# Altium project MiniPC.PrjPcb (part 5 of 17)

## Sheet Arria10_Power.SchDoc: Arria 10 Power Inputs
size B; DocumentNumber: 30; SheetNumber: 30; SheetTotal: 46
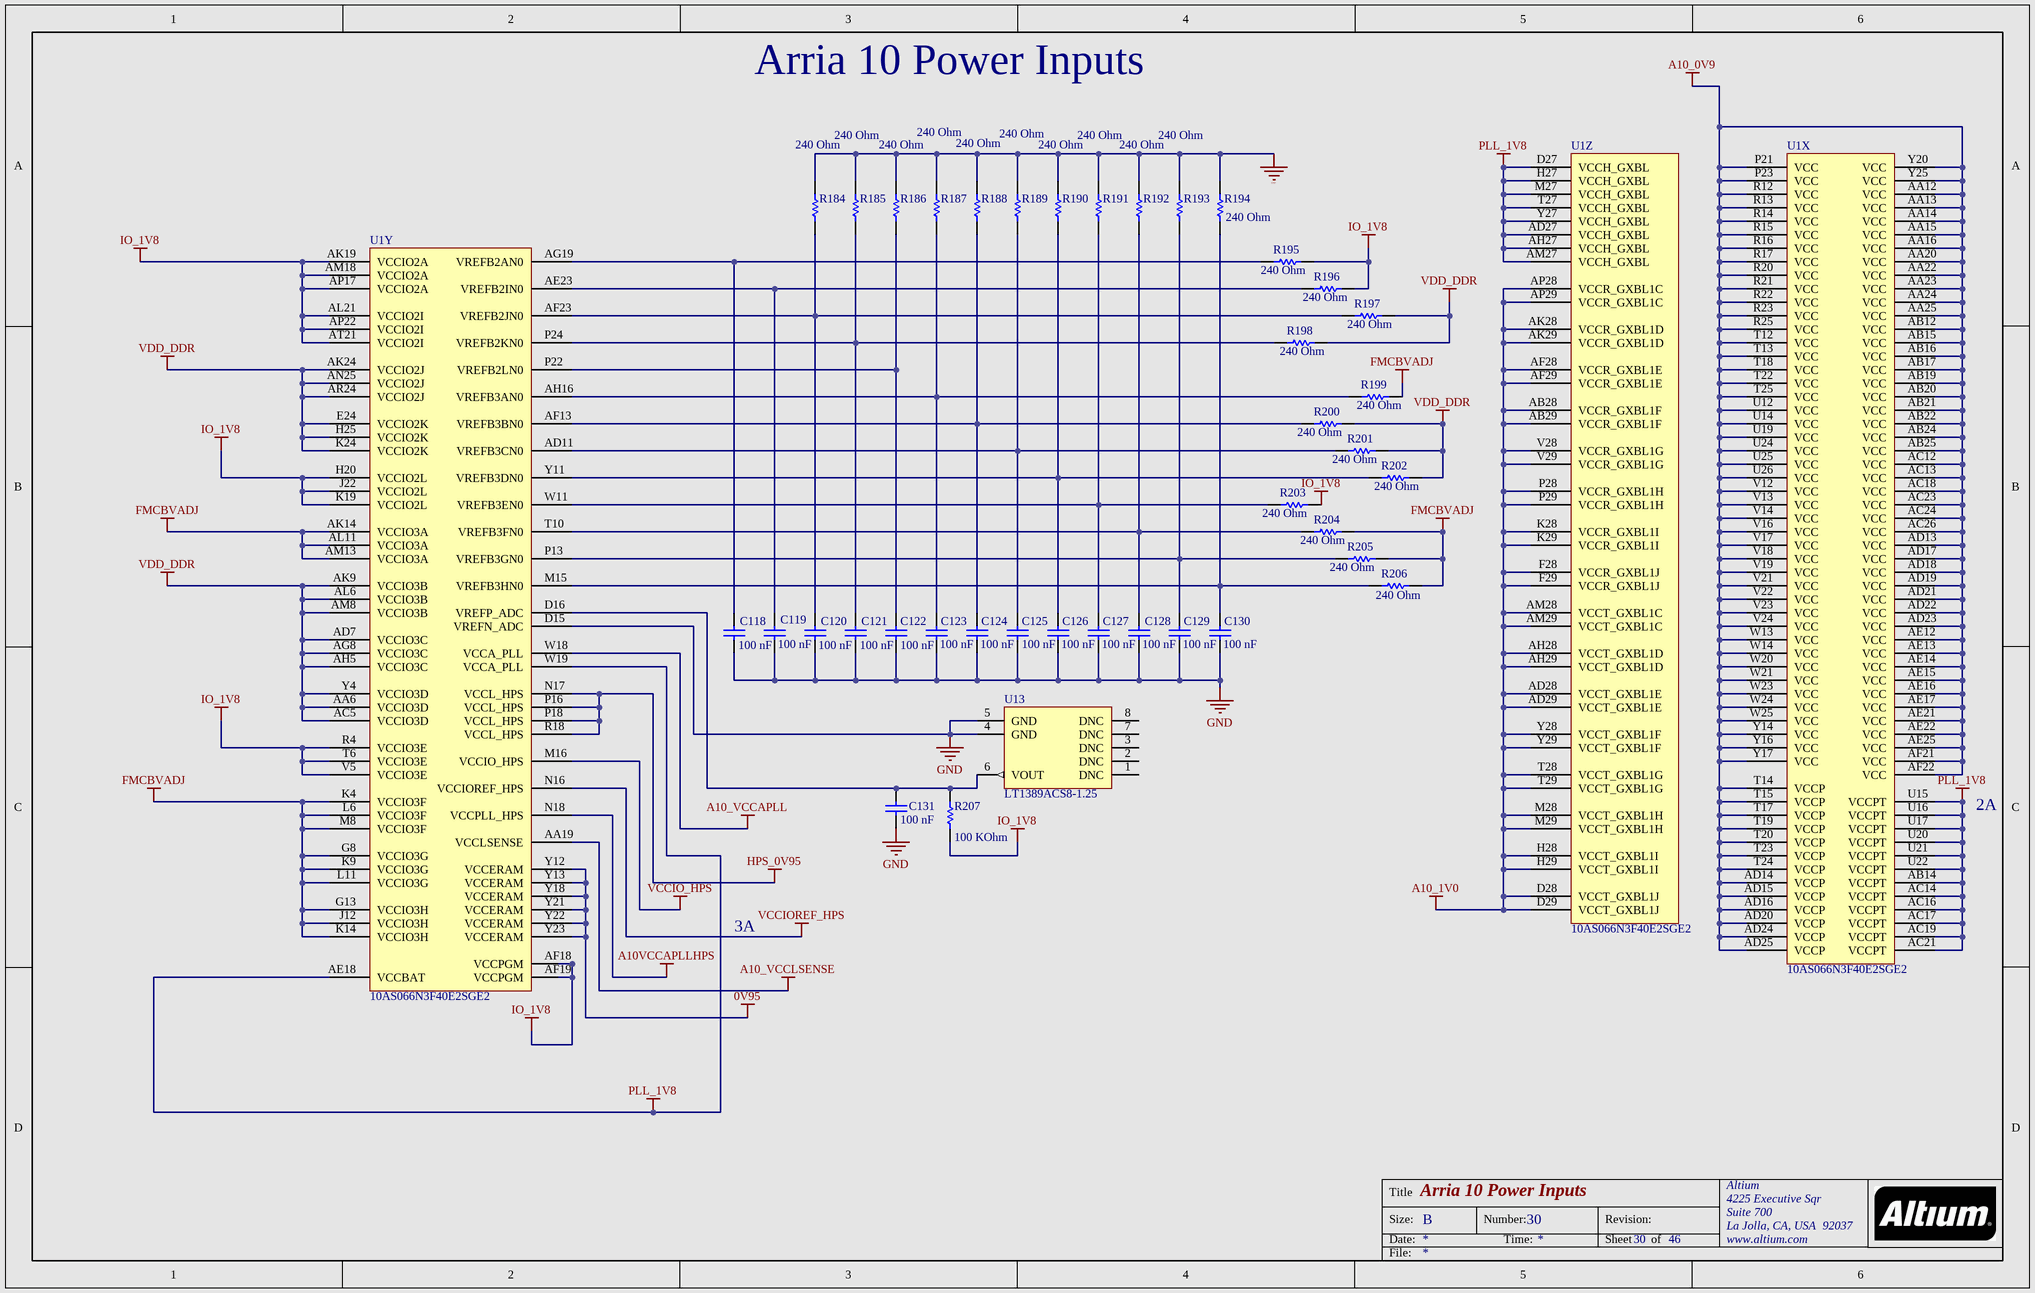
[diagram p19: Arria10_Power.SchDoc]

### Parts
C118  Capacitance: 100 nF  [CAPC0603X33X15LL03T05]  (hidden comment: GRM033R60J104KE19D)
C119  Capacitance: 100 nF  [CAPC0603X33X15LL03T05]  (hidden comment: GRM033R60J104KE19D)
C120  Capacitance: 100 nF  [CAPC0603X33X15LL03T05]  (hidden comment: GRM033R60J104KE19D)
C121  Capacitance: 100 nF  [CAPC0603X33X15LL03T05]  (hidden comment: GRM033R60J104KE19D)
C122  Capacitance: 100 nF  [CAPC0603X33X15LL03T05]  (hidden comment: GRM033R60J104KE19D)
C123  Capacitance: 100 nF  [CAPC0603X33X15LL03T05]  (hidden comment: GRM033R60J104KE19D)
C124  Capacitance: 100 nF  [CAPC0603X33X15LL03T05]  (hidden comment: GRM033R60J104KE19D)
C125  Capacitance: 100 nF  [CAPC0603X33X15LL03T05]  (hidden comment: GRM033R60J104KE19D)
C126  Capacitance: 100 nF  [CAPC0603X33X15LL03T05]  (hidden comment: GRM033R60J104KE19D)
C127  Capacitance: 100 nF  [CAPC0603X33X15LL03T05]  (hidden comment: GRM033R60J104KE19D)
C128  Capacitance: 100 nF  [CAPC0603X33X15LL03T05]  (hidden comment: GRM033R60J104KE19D)
C129  Capacitance: 100 nF  [CAPC0603X33X15LL03T05]  (hidden comment: GRM033R60J104KE19D)
C130  Capacitance: 100 nF  [CAPC0603X33X15LL03T05]  (hidden comment: GRM033R60J104KE19D)
C131  Capacitance: 100 nF  [CAPC1005X55X10LL05]  (hidden comment: C1005X7R1E104M)
R184  Resistance: 240 Ohm  [RESC1005X40X25ML05T05]  (hidden comment: ERJ-2GEJ241x)
R185  Resistance: 240 Ohm  [RESC1005X40X25ML05T05]  (hidden comment: ERJ-2GEJ241x)
R186  Resistance: 240 Ohm  [RESC1005X40X25ML05T05]  (hidden comment: ERJ-2GEJ241x)
R187  Resistance: 240 Ohm  [RESC1005X40X25ML05T05]  (hidden comment: ERJ-2GEJ241x)
R188  Resistance: 240 Ohm  [RESC1005X40X25ML05T05]  (hidden comment: ERJ-2GEJ241x)
R189  Resistance: 240 Ohm  [RESC1005X40X25ML05T05]  (hidden comment: ERJ-2GEJ241x)
R190  Resistance: 240 Ohm  [RESC1005X40X25ML05T05]  (hidden comment: ERJ-2GEJ241x)
R191  Resistance: 240 Ohm  [RESC1005X40X25ML05T05]  (hidden comment: ERJ-2GEJ241x)
R192  Resistance: 240 Ohm  [RESC1005X40X25ML05T05]  (hidden comment: ERJ-2GEJ241x)
R193  Resistance: 240 Ohm  [RESC1005X40X25ML05T05]  (hidden comment: ERJ-2GEJ241x)
R194  Resistance: 240 Ohm  [RESC1005X40X25ML05T05]  (hidden comment: ERJ-2GEJ241x)
R195  Resistance: 240 Ohm  [RESC1005X40X25ML05T05]  (hidden comment: ERJ-2GEJ241x)
R196  Resistance: 240 Ohm  [RESC1005X40X25ML05T05]  (hidden comment: ERJ-2GEJ241x)
R197  Resistance: 240 Ohm  [RESC1005X40X25ML05T05]  (hidden comment: ERJ-2GEJ241x)
R198  Resistance: 240 Ohm  [RESC1005X40X25ML05T05]  (hidden comment: ERJ-2GEJ241x)
R199  Resistance: 240 Ohm  [RESC1005X40X25ML05T05]  (hidden comment: ERJ-2GEJ241x)
R200  Resistance: 240 Ohm  [RESC1005X40X25ML05T05]  (hidden comment: ERJ-2GEJ241x)
R201  Resistance: 240 Ohm  [RESC1005X40X25ML05T05]  (hidden comment: ERJ-2GEJ241x)
R202  Resistance: 240 Ohm  [RESC1005X40X25ML05T05]  (hidden comment: ERJ-2GEJ241x)
R203  Resistance: 240 Ohm  [RESC1005X40X25ML05T05]  (hidden comment: ERJ-2GEJ241x)
R204  Resistance: 240 Ohm  [RESC1005X40X25ML05T05]  (hidden comment: ERJ-2GEJ241x)
R205  Resistance: 240 Ohm  [RESC1005X40X25ML05T05]  (hidden comment: ERJ-2GEJ241x)
R206  Resistance: 240 Ohm  [RESC1005X40X25ML05T05]  (hidden comment: ERJ-2GEJ241x)
R207  Resistance: 100 KOhm  [RESC1005X40X25LL05T05]  (hidden comment: ERJ-2RKF1003X)
U1  10AS066N3F40E2SGE2  [ALTR-FBGA1517_A-350]  (parts X,Y,Z of 31)
U13  LT1389ACS8-1.25  [LT-S8-8_M]

### Nets
0V95: U1.Y12(VCCERAM) U1.Y13(VCCERAM) U1.Y18(VCCERAM) U1.Y21(VCCERAM) U1.Y22(VCCERAM) U1.Y23(VCCERAM)
A10_0V9: U1.AA12(VCC) U1.AA13(VCC) U1.AA14(VCC) U1.AA15(VCC) U1.AA16(VCC) U1.AA20(VCC) U1.AA22(VCC) U1.AA23(VCC) U1.AA24(VCC) U1.AA25(VCC) U1.AB12(VCC) U1.AB15(VCC) U1.AB16(VCC) U1.AB17(VCC) U1.AB19(VCC) U1.AB20(VCC) U1.AB21(VCC) U1.AB22(VCC) U1.AB24(VCC) U1.AB25(VCC) U1.AC12(VCC) U1.AC13(VCC) U1.AC18(VCC) U1.AC23(VCC) U1.AC24(VCC) U1.AC26(VCC) U1.AD13(VCC) U1.AD14(VCCP) U1.AD15(VCCP) U1.AD16(VCCP) U1.AD17(VCC) U1.AD18(VCC) U1.AD19(VCC) U1.AD20(VCCP) U1.AD21(VCC) U1.AD22(VCC) U1.AD23(VCC) U1.AD24(VCCP) U1.AD25(VCCP) U1.AE12(VCC) U1.AE13(VCC) U1.AE14(VCC) U1.AE15(VCC) U1.AE16(VCC) U1.AE17(VCC) U1.AE21(VCC) U1.AE22(VCC) U1.AE25(VCC) U1.AF21(VCC) U1.AF22(VCC) U1.P21(VCC) U1.P23(VCC) U1.R12(VCC) U1.R13(VCC) U1.R14(VCC) U1.R15(VCC) U1.R16(VCC) U1.R17(VCC) U1.R20(VCC) U1.R21(VCC) U1.R22(VCC) U1.R23(VCC) U1.R25(VCC) U1.T12(VCC) U1.T13(VCC) U1.T14(VCCP) U1.T15(VCCP) U1.T17(VCCP) U1.T18(VCC) U1.T19(VCCP) U1.T20(VCCP) U1.T22(VCC) U1.T23(VCCP) U1.T24(VCCP) U1.T25(VCC) U1.U12(VCC) U1.U14(VCC) U1.U19(VCC) U1.U24(VCC) U1.U25(VCC) U1.U26(VCC) U1.V12(VCC) U1.V13(VCC) U1.V14(VCC) U1.V16(VCC) U1.V17(VCC) U1.V18(VCC) U1.V19(VCC) U1.V21(VCC) U1.V22(VCC) U1.V23(VCC) U1.V24(VCC) U1.W13(VCC) U1.W14(VCC) U1.W20(VCC) U1.W21(VCC) U1.W23(VCC) U1.W24(VCC) U1.W25(VCC) U1.Y14(VCC) U1.Y16(VCC) U1.Y17(VCC) U1.Y20(VCC) U1.Y25(VCC)
A10_1V0: U1.AB28(VCCR_GXBL1F) U1.AB29(VCCR_GXBL1F) U1.AD28(VCCT_GXBL1E) U1.AD29(VCCT_GXBL1E) U1.AF28(VCCR_GXBL1E) U1.AF29(VCCR_GXBL1E) U1.AH28(VCCT_GXBL1D) U1.AH29(VCCT_GXBL1D) U1.AK28(VCCR_GXBL1D) U1.AK29(VCCR_GXBL1D) U1.AM28(VCCT_GXBL1C) U1.AM29(VCCT_GXBL1C) U1.AP28(VCCR_GXBL1C) U1.AP29(VCCR_GXBL1C) U1.D28(VCCT_GXBL1J) U1.D29(VCCT_GXBL1J) U1.F28(VCCR_GXBL1J) U1.F29(VCCR_GXBL1J) U1.H28(VCCT_GXBL1I) U1.H29(VCCT_GXBL1I) U1.K28(VCCR_GXBL1I) U1.K29(VCCR_GXBL1I) U1.M28(VCCT_GXBL1H) U1.M29(VCCT_GXBL1H) U1.P28(VCCR_GXBL1H) U1.P29(VCCR_GXBL1H) U1.T28(VCCT_GXBL1G) U1.T29(VCCT_GXBL1G) U1.V28(VCCR_GXBL1G) U1.V29(VCCR_GXBL1G) U1.Y28(VCCT_GXBL1F) U1.Y29(VCCT_GXBL1F)
A10_VCCAPLL: U1.W18(VCCA_PLL)
A10_VCCLSENSE: U1.AA19(VCCLSENSE)
A10VCCAPLLHPS: U1.N18(VCCPLL_HPS)
FMCBVADJ: R199.1 R204.1 R205.1 R206.1 U1.AK14(VCCIO3A) U1.AL11(VCCIO3A) U1.AM13(VCCIO3A) U1.G8(VCCIO3G) U1.G13(VCCIO3H) U1.J12(VCCIO3H) U1.K4(VCCIO3F) U1.K9(VCCIO3G) U1.K14(VCCIO3H) U1.L6(VCCIO3F) U1.L11(VCCIO3G) U1.M8(VCCIO3F)
GND: C118.1 C119.1 C120.1 C121.1 C122.1 C123.1 C124.1 C125.1 C126.1 C127.1 C128.1 C129.1 C130.1 C131.1 R184.2 R185.2 R186.2 R187.2 R188.2 R189.2 R190.2 R191.2 R192.2 R193.2 R194.1 U1.D15(VREFN_ADC) U13.4(GND) U13.5(GND)
HPS_0V95: U1.N17(VCCL_HPS) U1.P16(VCCL_HPS) U1.P18(VCCL_HPS) U1.R18(VCCL_HPS)
IO_1V8: R195.1 R196.1 R203.1 R207.1 U1.AF18(VCCPGM) U1.AF19(VCCPGM) U1.AK19(VCCIO2A) U1.AL21(VCCIO2I) U1.AM18(VCCIO2A) U1.AP17(VCCIO2A) U1.AP22(VCCIO2I) U1.AT21(VCCIO2I) U1.H20(VCCIO2L) U1.J22(VCCIO2L) U1.K19(VCCIO2L) U1.R4(VCCIO3E) U1.T6(VCCIO3E) U1.V5(VCCIO3E)
PLL_1V8: U1.AB14(VCCPT) U1.AC14(VCCPT) U1.AC16(VCCPT) U1.AC17(VCCPT) U1.AC19(VCCPT) U1.AC21(VCCPT) U1.AD27(VCCH_GXBL) U1.AE18(VCCBAT) U1.AH27(VCCH_GXBL) U1.AM27(VCCH_GXBL) U1.D27(VCCH_GXBL) U1.H27(VCCH_GXBL) U1.M27(VCCH_GXBL) U1.T27(VCCH_GXBL) U1.U15(VCCPT) U1.U16(VCCPT) U1.U17(VCCPT) U1.U20(VCCPT) U1.U21(VCCPT) U1.U22(VCCPT) U1.W19(VCCA_PLL) U1.Y27(VCCH_GXBL)
VCCIO_HPS: U1.M16(VCCIO_HPS)
VCCIOREF_HPS: U1.N16(VCCIOREF_HPS)
VDD_DDR: R197.1 R198.1 R200.1 R201.1 R202.1 U1.AA6(VCCIO3D) U1.AC5(VCCIO3D) U1.AD7(VCCIO3C) U1.AG8(VCCIO3C) U1.AH5(VCCIO3C) U1.AK9(VCCIO3B) U1.AK24(VCCIO2J) U1.AL6(VCCIO3B) U1.AM8(VCCIO3B) U1.AN25(VCCIO2J) U1.AR24(VCCIO2J) U1.E24(VCCIO2K) U1.H25(VCCIO2K) U1.K24(VCCIO2K) U1.Y4(VCCIO3D)
NetC118_2: C118.2 R195.2 U1.AG19(VREFB2AN0)
NetC119_2: C119.2 R196.2 U1.AE23(VREFB2IN0)
NetC120_2: C120.2 R184.1 R197.2 U1.AF23(VREFB2JN0)
NetC121_2: C121.2 R185.1 R198.2 U1.P24(VREFB2KN0)
NetC122_2: C122.2 R186.1 U1.P22(VREFB2LN0)
NetC123_2: C123.2 R187.1 R199.2 U1.AH16(VREFB3AN0)
NetC124_2: C124.2 R188.1 R200.2 U1.AF13(VREFB3BN0)
NetC125_2: C125.2 R189.1 R201.2 U1.AD11(VREFB3CN0)
NetC126_2: C126.2 R190.1 R202.2 U1.Y11(VREFB3DN0)
NetC127_2: C127.2 R191.1 R203.2 U1.W11(VREFB3EN0)
NetC128_2: C128.2 R192.1 R204.2 U1.T10(VREFB3FN0)
NetC129_2: C129.2 R193.1 R205.2 U1.P13(VREFB3GN0)
NetC130_2: C130.2 R194.2 R206.2 U1.M15(VREFB3HN0)
NetC131_2: C131.2 R207.2 U1.D16(VREFP_ADC) U13.6(VOUT)

Not connected (* = marked no-connect by the designer): U13 1(DNC) 2(DNC) 3(DNC) 7(DNC) 8(DNC)

### Notes on the sheet
- 2A
- 3A
- Title
- Size:
- Date:
- B
- Number:
- Time:
- Revision:
- Sheet
- of
- File:

### Library data of the parts
C118-C130 = CMP-2010-01652-4: Chip Capacitor, 100 nF, +/- 10%, 6.3 V, -55 to 85 degC, 0201 (0603 Metric), RoHS, Tape and Reel; Manufacturer: Basic Passives; Voltage Rating: 6.3 V; Type (Capacitors): X5R; Voltage Rating (DC): 3 V; Case\/Package: 0201; Tolerance: 10%; Min Operating Temperature: -55 degC; PartNumber: GRM033R60J104KE19D; Mounting Technology: Surface Mount; RoHSCompliant: true; Max Operating Temperature: 85 degC; Package Quantity: 15000; Packaging: Tape and Reel; Case Code (Imperial): 0201; Width: 0.3 mm; ComponentLink1URL: http://www.murata.com/; Case Code (Metric): 0603; ComponentLink1Description: Manufacturer URL; REACH SVHC: No SVHC; Height: 0.3 mm; Length: 0.6 mm; PackageDescription: 2-Pin Surface Mount Device, Body 0.6 x 0.3 mm; ComponentLink2Description: Datasheet; Pins: 2; PackageReference: 0201; Mount: Surface Mount; ComponentLink2URL: http://search.murata.co.jp/Ceramy/image/img/A01X/G101/ENG/GRM033R60J104KE19-01.pdf; DatasheetVersion: 03/2016; Radiation Hardening: No
C131 = CMP-1663-00009-2: Chip Capacitor, 0.1 uF, +/- 20%, 25 V, -55 to 125 degC, 0402 (1005 Metric), RoHS, Tape and Reel; Type (Capacitors): X7R; Voltage Rating: 25 V; Case\/Package: 0402; Tolerance: 20%; Mounting Technology: Surface Mount; Max Operating Temperature: 125 degC; ComponentLink2URL: http://www.farnell.com/datasheets/1571323.pdf; ComponentLink1URL: http://www.tdk.com/; RoHSCompliant: true; Packaging: Tape and Reel; ComponentLink2Description: Datasheet; Case Code (Imperial): 0402; DatasheetVersion: 09/2011; ComponentLink1Description: Manufacturer URL; PackageDescription: 2-Pin Surface Mount Device, Body 1 x 0.5 mm; PackageReference: 0402; Min Operating Temperature: -55 degC; Case Code (Metric): 1005; Height: 0.5 mm; Package Quantity: 10000; Width: 0.5 mm; Pins: 2; Voltage Rating (DC): 25 V; PartNumber: C1005X7R1E104M; Mount: Surface Mount; Length: 1 mm
R184-R206 = CMP-2002-00493-3: Chip Resistor, 240 Ohm, +/- 5%, 100 mW, -55 to 155 degC, 0402 (1005 Metric), RoHS, Tape and Reel; Manufacturer: Basic Passives; Power Rating: 100 mW; Voltage Rating: 50 V; Case\/Package: 0402; Tolerance: 5%; Height: 0.35 mm; Case Code (Imperial): 0402; Width: 0.5 mm; Case Code (Metric): 1005; Min Operating Temperature: -55 degC; Package Quantity: 10000; PartNumber: ERJ-2GEJ241x; ComponentLink1Description: Manufacturer URL; REACH SVHC: Yes; Length: 1 mm; Mount: Surface Mount; ComponentLink1URL: http://www.panasonic.com/; Packaging: Tape and Reel; PackageDescription: 2-Pin Surface Mount Device, Body 1 x 0.5 mm; RoHSCompliant: true; Max Operating Temperature: 155 degC; Mounting Technology: Surface Mount; PackageReference: 0402; ComponentLink2Description: Datasheet; Radiation Hardening: No; DatasheetVersion: 03/2015; Pins: 2; ComponentLink2URL: http://industrial.panasonic.com/cdbs/www-data/pdf/RDA0000/AOA0000C84.pdf
R207 = CMP-2002-00608-3: Chip Resistor, 100 KOhm, +/- 1%, 100 mW, -55 to 155 degC, 0402 (1005 Metric), RoHS, Tape and Reel; Manufacturer: Basic Passives; Voltage Rating: 50 V; Power Rating: 100 mW; Case\/Package: 0402; Tolerance: 1%; Height: 0.35 mm; ComponentLink1Description: Manufacturer URL; Packaging: Tape and Reel; Min Operating Temperature: -55 degC; RoHSCompliant: true; PackageDescription: 2-Pin Surface Mount Device, Body 1 x 0.5 mm; Mount: Surface Mount; Package Quantity: 10000; Max Operating Temperature: 155 degC; ComponentLink1URL: http://www.panasonic.com/; Mounting Technology: Surface Mount; PartNumber: ERJ-2RKF1003X; Case Code (Metric): 1005; Case Code (Imperial): 0402; REACH SVHC: Yes; Length: 1 mm; Width: 0.5 mm; DatasheetVersion: 04/2015; Pins: 2; ComponentLink2Description: Datasheet; ComponentLink2URL: http://industrial.panasonic.com/cdbs/www-data/pdf/RDA0000/AOA0000C86.pdf; PackageReference: 0402; Radiation Hardening: No
U1 = CMP-1689-00006-3: Arria 10 SX Family, 588 I/O Pins, 16 Fractional PLLs, 1517-Pin FBGA, Speed Grade 2, Extended Grade, RoHS; ComponentLink3Description: Package Specification; PackageVersion: Rev. 5.0, 01/2016; ComponentLink3URL: https://www.altera.com/content/dam/altera-www/global/en_US/pdfs/literature/packaging/04r00461-04.pdf; ComponentLink2Description: Datasheet; Code_JEDEC: MS-034; Mounting Technology: Surface Mount; PartNumber: 10AS066N3F40E2SGE2; PackageDescription: 1517-Pin FineLine Ball-Grid Array (FBGA), Body 40 x 40 mm, Pitch 1 mm; ComponentLink2URL: https://www.altera.com/content/dam/altera-www/global/en_US/pdfs/literature/hb/arria-10/a10_datasheet.pdf; ComponentLink1URL: https://www.altera.com/; DatasheetVersion: Rev. 2016-06-24, 06/2016; ComponentLink1Description: Manufacturer URL
U13 = CMP-1701-00004-2: Nanopower Precision Shunt Voltage Reference, 1.25 V, 0.05%, 10 ppm/degC, 0 to 70 degC, 8-Pin S8, Tube; Current - Cathode: 600µA; Output Type: Fixed; Current - Output: 20mA; Noise - 0.1Hz to 10Hz: 25µVp-p; Voltage - Output (Min/Fixed): 1.25V; Product Training Modules: Voltage Reference Basics; Temperature Coefficient: 10ppm/°C; ComponentLink2URL: http://cds.linear.com/docs/en/datasheet/1389fa.pdf; Tolerance: ±0.05%; Series: -; Family: PMIC - Voltage Reference; Mounting Type: Surface Mount; ComponentLink1Description: Manufacturer URL; Noise - 10Hz to 10kHz: -; Category: Integrated Circuits (ICs); Operating Temperature: 0°C ~ 70°C (TA); Current - Supply: -; Standard Package: 100; DatasheetVersion: Rev. A; Reference Type: Shunt; Voltage - Input: -; Package / Case: 8-SOIC (0.154&quot;, 3.90mm Width); Mounting Technology: Surface Mount; ComponentLink1URL: http://www.linear.com/; ComponentLink2Description: Datasheet; Packaging: Tube; PackageDescription: 8-Pin Small Outline Integrated Package, Body 5 x 4 mm, Pitch 1.27 mm; Voltage - Output (Max): -; PartNumber: LT1389ACS8-1.25

## Sheet Arria10_Ground.SchDoc: Arria 10 Ground Connections
size B; DocumentNumber: 29; SheetNumber: 29; SheetTotal: 46
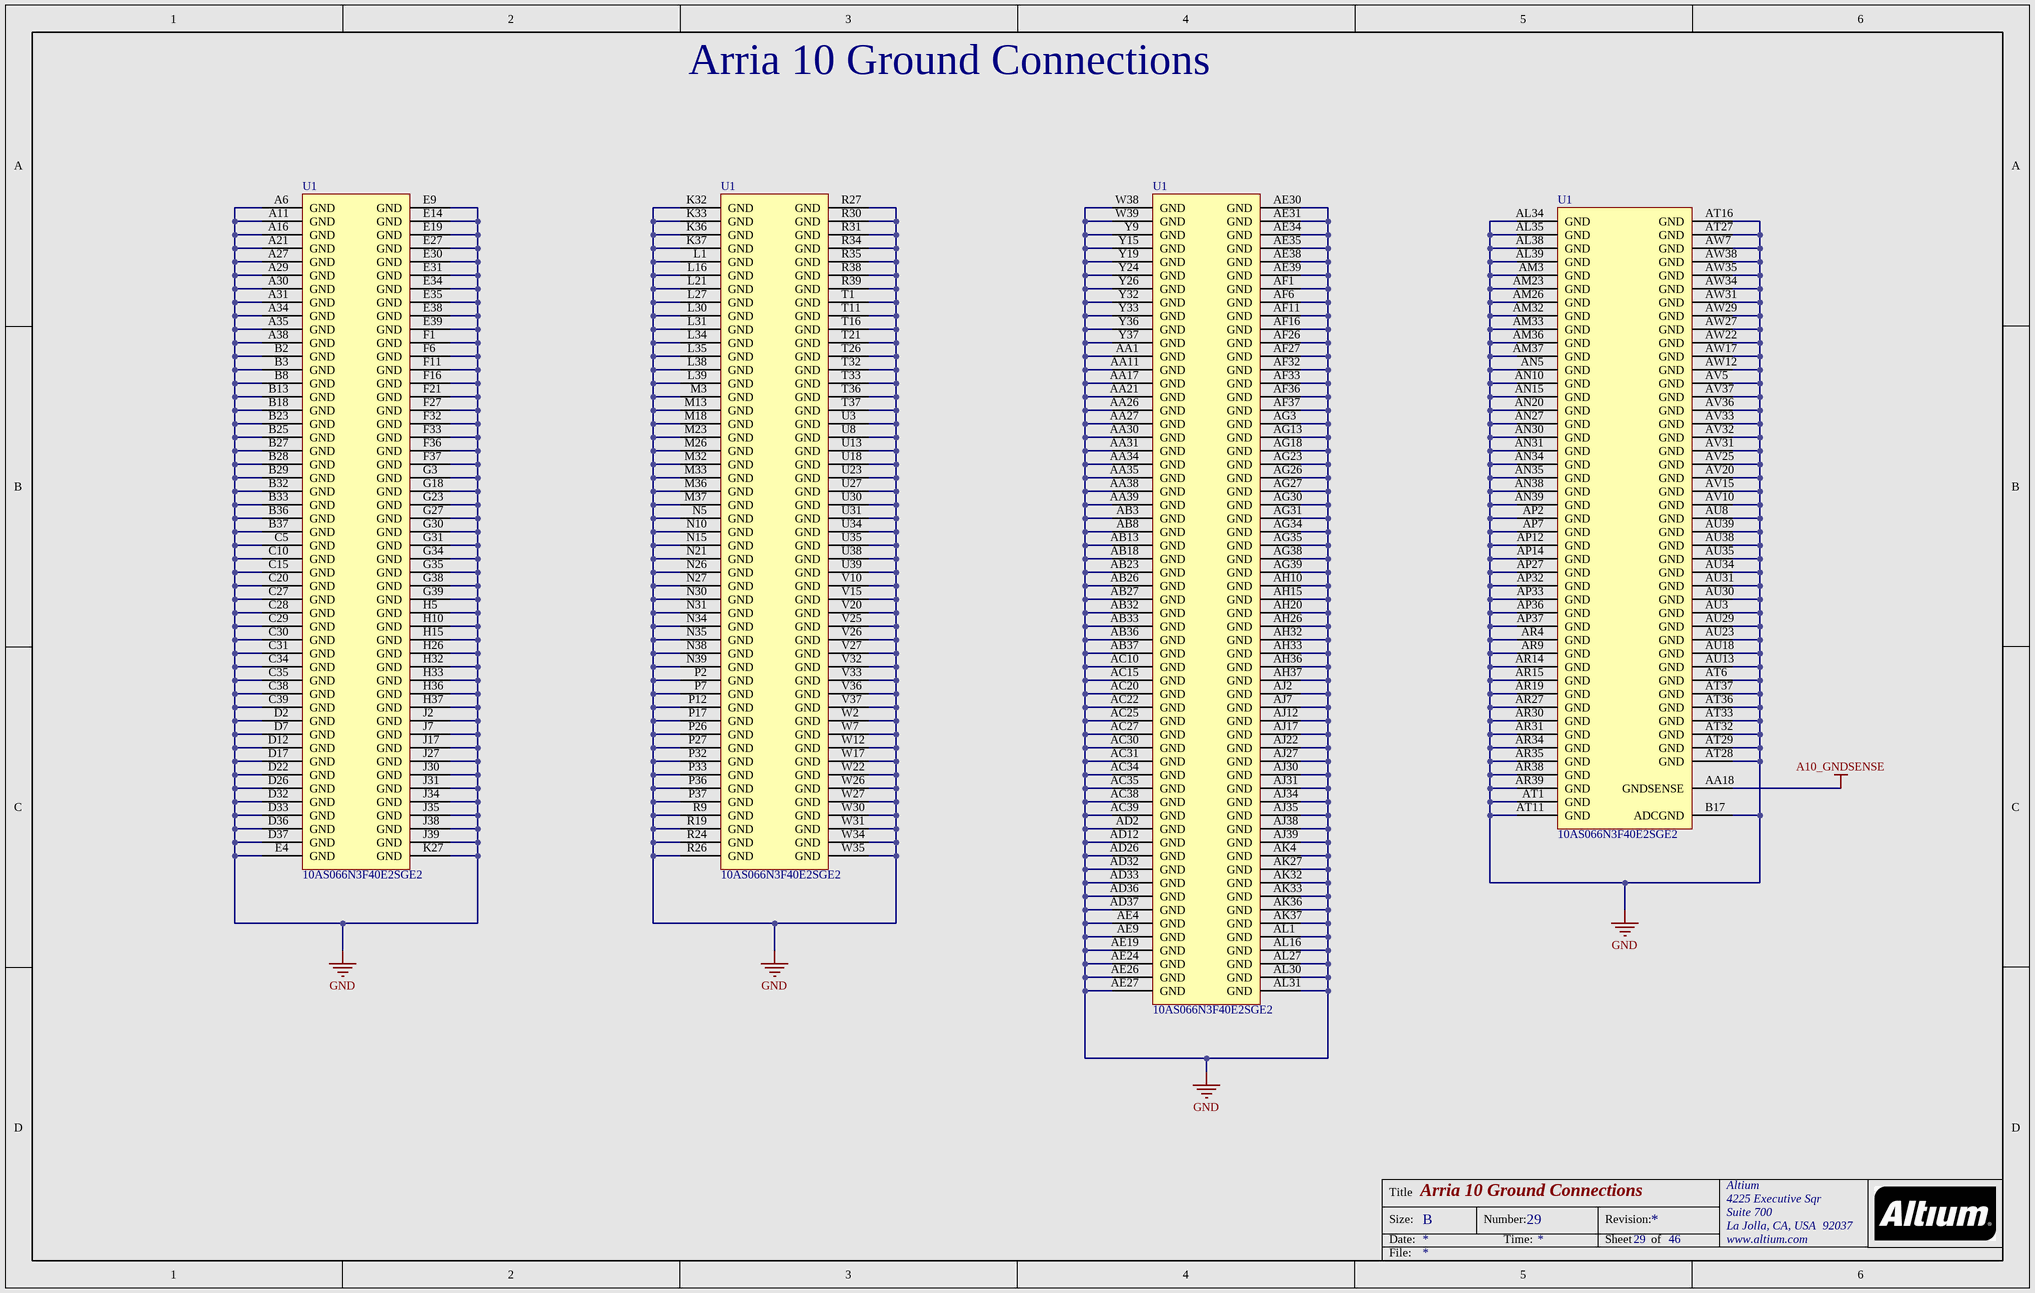
[diagram p20: Arria10_Ground.SchDoc]

### Parts
U1  10AS066N3F40E2SGE2  [ALTR-FBGA1517_A-350]  (parts 27,28,29,30 of 31)

### Nets
A10_GNDSENSE: U1.AA18(GNDSENSE)
GND: U1.A6(GND) U1.A11(GND) U1.A16(GND) U1.A21(GND) U1.A27(GND) U1.A29(GND) U1.A30(GND) U1.A31(GND) U1.A34(GND) U1.A35(GND) U1.A38(GND) U1.AA1(GND) U1.AA11(GND) U1.AA17(GND) U1.AA21(GND) U1.AA26(GND) U1.AA27(GND) U1.AA30(GND) U1.AA31(GND) U1.AA34(GND) U1.AA35(GND) U1.AA38(GND) U1.AA39(GND) U1.AB3(GND) U1.AB8(GND) U1.AB13(GND) U1.AB18(GND) U1.AB23(GND) U1.AB26(GND) U1.AB27(GND) U1.AB32(GND) U1.AB33(GND) U1.AB36(GND) U1.AB37(GND) U1.AC10(GND) U1.AC15(GND) U1.AC20(GND) U1.AC22(GND) U1.AC25(GND) U1.AC27(GND) U1.AC30(GND) U1.AC31(GND) U1.AC34(GND) U1.AC35(GND) U1.AC38(GND) U1.AC39(GND) U1.AD2(GND) U1.AD12(GND) U1.AD26(GND) U1.AD32(GND) U1.AD33(GND) U1.AD36(GND) U1.AD37(GND) U1.AE4(GND) U1.AE9(GND) U1.AE19(GND) U1.AE24(GND) U1.AE26(GND) U1.AE27(GND) U1.AE30(GND) U1.AE31(GND) U1.AE34(GND) U1.AE35(GND) U1.AE38(GND) U1.AE39(GND) U1.AF1(GND) U1.AF6(GND) U1.AF11(GND) U1.AF16(GND) U1.AF26(GND) U1.AF27(GND) U1.AF32(GND) U1.AF33(GND) U1.AF36(GND) U1.AF37(GND) U1.AG3(GND) U1.AG13(GND) U1.AG18(GND) U1.AG23(GND) U1.AG26(GND) U1.AG27(GND) U1.AG30(GND) U1.AG31(GND) U1.AG34(GND) U1.AG35(GND) U1.AG38(GND) U1.AG39(GND) U1.AH10(GND) U1.AH15(GND) U1.AH20(GND) U1.AH26(GND) U1.AH32(GND) U1.AH33(GND) U1.AH36(GND) U1.AH37(GND) U1.AJ2(GND) U1.AJ7(GND) U1.AJ12(GND) U1.AJ17(GND) U1.AJ22(GND) U1.AJ27(GND) U1.AJ30(GND) U1.AJ31(GND) U1.AJ34(GND) U1.AJ35(GND) U1.AJ38(GND) U1.AJ39(GND) U1.AK4(GND) U1.AK27(GND) U1.AK32(GND) U1.AK33(GND) U1.AK36(GND) U1.AK37(GND) U1.AL1(GND) U1.AL16(GND) U1.AL27(GND) U1.AL30(GND) U1.AL31(GND) U1.AL34(GND) U1.AL35(GND) U1.AL38(GND) U1.AL39(GND) U1.AM3(GND) U1.AM23(GND) U1.AM26(GND) U1.AM32(GND) U1.AM33(GND) U1.AM36(GND) U1.AM37(GND) U1.AN5(GND) U1.AN10(GND) U1.AN15(GND) U1.AN20(GND) U1.AN27(GND) U1.AN30(GND) U1.AN31(GND) U1.AN34(GND) U1.AN35(GND) U1.AN38(GND) U1.AN39(GND) U1.AP2(GND) U1.AP7(GND) U1.AP12(GND) U1.AP14(GND) U1.AP27(GND) U1.AP32(GND) U1.AP33(GND) U1.AP36(GND) U1.AP37(GND) U1.AR4(GND) U1.AR9(GND) U1.AR14(GND) U1.AR15(GND) U1.AR19(GND) U1.AR27(GND) U1.AR30(GND) U1.AR31(GND) U1.AR34(GND) U1.AR35(GND) U1.AR38(GND) U1.AR39(GND) U1.AT1(GND) U1.AT6(GND) U1.AT11(GND) U1.AT16(GND) U1.AT27(GND) U1.AT28(GND) U1.AT29(GND) U1.AT32(GND) U1.AT33(GND) U1.AT36(GND) U1.AT37(GND) U1.AU3(GND) U1.AU8(GND) U1.AU13(GND) U1.AU18(GND) U1.AU23(GND) U1.AU29(GND) U1.AU30(GND) U1.AU31(GND) U1.AU34(GND) U1.AU35(GND) U1.AU38(GND) U1.AU39(GND) U1.AV5(GND) U1.AV10(GND) U1.AV15(GND) U1.AV20(GND) U1.AV25(GND) U1.AV31(GND) U1.AV32(GND) U1.AV33(GND) U1.AV36(GND) U1.AV37(GND) U1.AW7(GND) U1.AW12(GND) U1.AW17(GND) U1.AW22(GND) U1.AW27(GND) U1.AW29(GND) U1.AW31(GND) U1.AW34(GND) U1.AW35(GND) U1.AW38(GND) U1.B2(GND) U1.B3(GND) U1.B8(GND) U1.B13(GND) U1.B17(ADCGND) U1.B18(GND) U1.B23(GND) U1.B25(GND) U1.B27(GND) U1.B28(GND) U1.B29(GND) U1.B32(GND) U1.B33(GND) U1.B36(GND) U1.B37(GND) U1.C5(GND) U1.C10(GND) U1.C15(GND) U1.C20(GND) U1.C27(GND) U1.C28(GND) U1.C29(GND) U1.C30(GND) U1.C31(GND) U1.C34(GND) U1.C35(GND) U1.C38(GND) U1.C39(GND) U1.D2(GND) U1.D7(GND) U1.D12(GND) U1.D17(GND) U1.D22(GND) U1.D26(GND) U1.D32(GND) U1.D33(GND) U1.D36(GND) U1.D37(GND) U1.E4(GND) U1.E9(GND) U1.E14(GND) U1.E19(GND) U1.E27(GND) U1.E30(GND) U1.E31(GND) U1.E34(GND) U1.E35(GND) U1.E38(GND) U1.E39(GND) U1.F1(GND) U1.F6(GND) U1.F11(GND) U1.F16(GND) U1.F21(GND) U1.F27(GND) U1.F32(GND) U1.F33(GND) U1.F36(GND) U1.F37(GND) U1.G3(GND) U1.G18(GND) U1.G23(GND) U1.G27(GND) U1.G30(GND) U1.G31(GND) U1.G34(GND) U1.G35(GND) U1.G38(GND) U1.G39(GND) U1.H5(GND) U1.H10(GND) U1.H15(GND) U1.H26(GND) U1.H32(GND) U1.H33(GND) U1.H36(GND) U1.H37(GND) U1.J2(GND) U1.J7(GND) U1.J17(GND) U1.J27(GND) U1.J30(GND) U1.J31(GND) U1.J34(GND) U1.J35(GND) U1.J38(GND) U1.J39(GND) U1.K27(GND) U1.K32(GND) U1.K33(GND) U1.K36(GND) U1.K37(GND) U1.L1(GND) U1.L16(GND) U1.L21(GND) U1.L27(GND) U1.L30(GND) U1.L31(GND) U1.L34(GND) U1.L35(GND) U1.L38(GND) U1.L39(GND) U1.M3(GND) U1.M13(GND) U1.M18(GND) U1.M23(GND) U1.M26(GND) U1.M32(GND) U1.M33(GND) U1.M36(GND) U1.M37(GND) U1.N5(GND) U1.N10(GND) U1.N15(GND) U1.N21(GND) U1.N26(GND) U1.N27(GND) U1.N30(GND) U1.N31(GND) U1.N34(GND) U1.N35(GND) U1.N38(GND) U1.N39(GND) U1.P2(GND) U1.P7(GND) U1.P12(GND) U1.P17(GND) U1.P26(GND) U1.P27(GND) U1.P32(GND) U1.P33(GND) U1.P36(GND) U1.P37(GND) U1.R9(GND) U1.R19(GND) U1.R24(GND) U1.R26(GND) U1.R27(GND) U1.R30(GND) U1.R31(GND) U1.R34(GND) U1.R35(GND) U1.R38(GND) U1.R39(GND) U1.T1(GND) U1.T11(GND) U1.T16(GND) U1.T21(GND) U1.T26(GND) U1.T32(GND) U1.T33(GND) U1.T36(GND) U1.T37(GND) U1.U3(GND) U1.U8(GND) U1.U13(GND) U1.U18(GND) U1.U23(GND) U1.U27(GND) U1.U30(GND) U1.U31(GND) U1.U34(GND) U1.U35(GND) U1.U38(GND) U1.U39(GND) U1.V10(GND) U1.V15(GND) U1.V20(GND) U1.V25(GND) U1.V26(GND) U1.V27(GND) U1.V32(GND) U1.V33(GND) U1.V36(GND) U1.V37(GND) U1.W2(GND) U1.W7(GND) U1.W12(GND) U1.W17(GND) U1.W22(GND) U1.W26(GND) U1.W27(GND) U1.W30(GND) U1.W31(GND) U1.W34(GND) U1.W35(GND) U1.W38(GND) U1.W39(GND) U1.Y9(GND) U1.Y15(GND) U1.Y19(GND) U1.Y24(GND) U1.Y26(GND) U1.Y32(GND) U1.Y33(GND) U1.Y36(GND) U1.Y37(GND)

### Notes on the sheet
- Title
- Size:
- Date:
- B
- Number:
- Time:
- Revision:
- Sheet
- of
- File:

### Library data of the parts
U1 = CMP-1689-00006-3: as U1 on sheet Arria10_Power; ComponentLink3Description: Package Specification; PackageVersion: Rev. 5.0, 01/2016; ComponentLink3URL: https://www.altera.com/content/dam/altera-www/global/en_US/pdfs/literature/packaging/04r00461-04.pdf; ComponentLink2Description: Datasheet; Code_JEDEC: MS-034; Mounting Technology: Surface Mount; PartNumber: 10AS066N3F40E2SGE2; PackageDescription: 1517-Pin FineLine Ball-Grid Array (FBGA), Body 40 x 40 mm, Pitch 1 mm; ComponentLink2URL: https://www.altera.com/content/dam/altera-www/global/en_US/pdfs/literature/hb/arria-10/a10_datasheet.pdf; ComponentLink1URL: https://www.altera.com/; DatasheetVersion: Rev. 2016-06-24, 06/2016; ComponentLink1Description: Manufacturer URL

## Sheet DDR4.SchDoc: DDR4
size B; DocumentNumber: 2; SheetNumber: 2; SheetTotal: 46
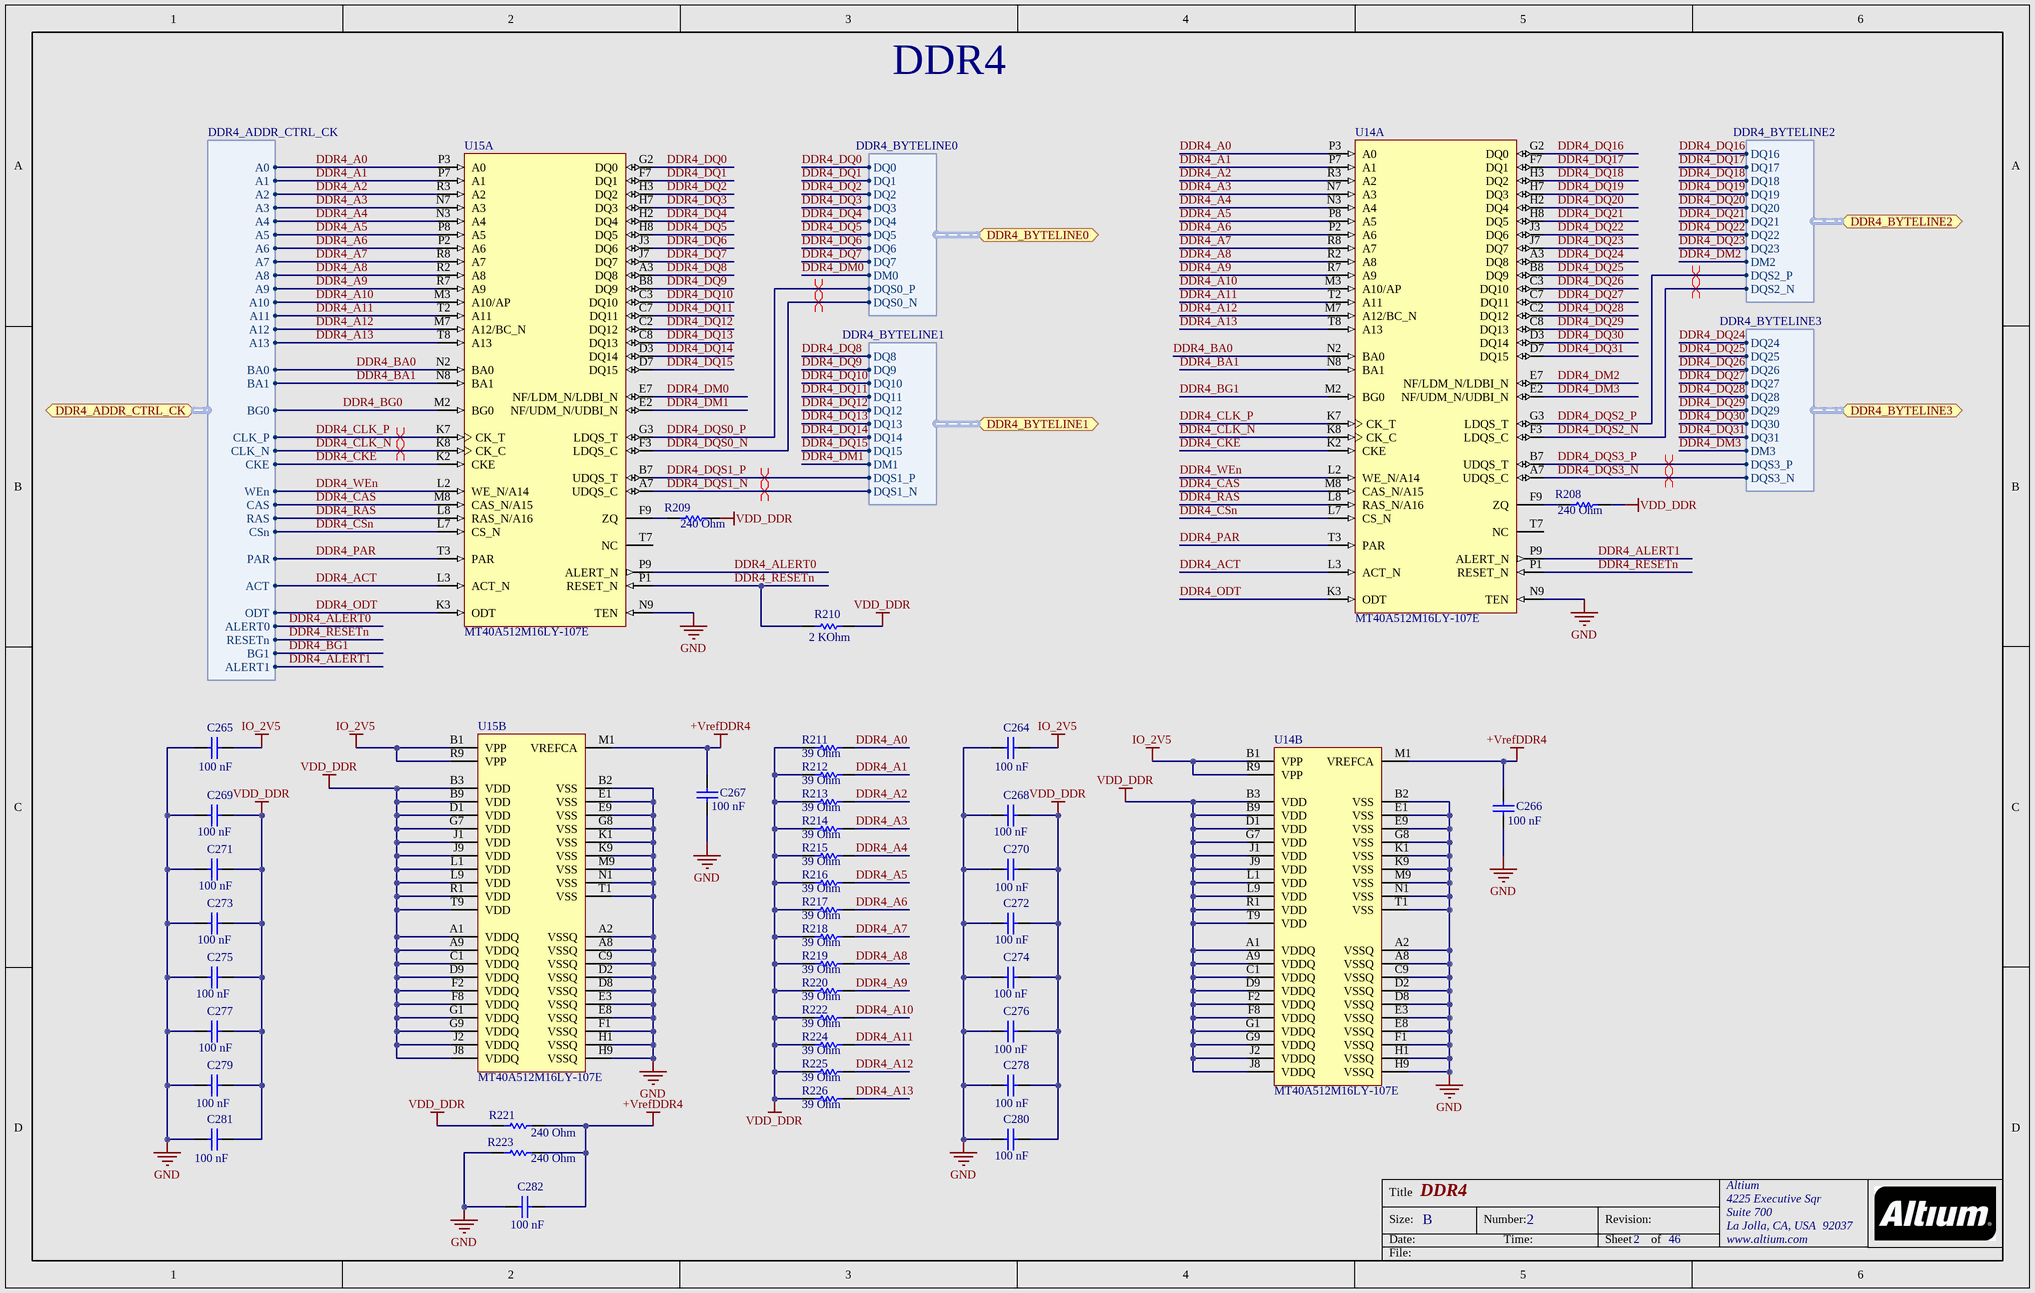
[diagram p21: DDR4.SchDoc]

### Parts
C264  Capacitance: 100 nF  [CAPC0603X33X15LL03T05]  (hidden comment: GRM033R60J104KE19D)
C265  Capacitance: 100 nF  [CAPC0603X33X15LL03T05]  (hidden comment: GRM033R60J104KE19D)
C266  Capacitance: 100 nF  [CAPC0603X33X15LL03T05]  (hidden comment: GRM033R60J104KE19D)
C267  Capacitance: 100 nF  [CAPC0603X33X15LL03T05]  (hidden comment: GRM033R60J104KE19D)
C268  Capacitance: 100 nF  [CAPC0603X33X15LL03T05]  (hidden comment: GRM033R60J104KE19D)
C269  Capacitance: 100 nF  [CAPC0603X33X15LL03T05]  (hidden comment: GRM033R60J104KE19D)
C270  Capacitance: 100 nF  [CAPC0603X33X15LL03T05]  (hidden comment: GRM033R60J104KE19D)
C271  Capacitance: 100 nF  [CAPC0603X33X15LL03T05]  (hidden comment: GRM033R60J104KE19D)
C272  Capacitance: 100 nF  [CAPC0603X33X15LL03T05]  (hidden comment: GRM033R60J104KE19D)
C273  Capacitance: 100 nF  [CAPC0603X33X15LL03T05]  (hidden comment: GRM033R60J104KE19D)
C274  Capacitance: 100 nF  [CAPC0603X33X15LL03T05]  (hidden comment: GRM033R60J104KE19D)
C275  Capacitance: 100 nF  [CAPC0603X33X15LL03T05]  (hidden comment: GRM033R60J104KE19D)
C276  Capacitance: 100 nF  [CAPC0603X33X15LL03T05]  (hidden comment: GRM033R60J104KE19D)
C277  Capacitance: 100 nF  [CAPC0603X33X15LL03T05]  (hidden comment: GRM033R60J104KE19D)
C278  Capacitance: 100 nF  [CAPC0603X33X15LL03T05]  (hidden comment: GRM033R60J104KE19D)
C279  Capacitance: 100 nF  [CAPC0603X33X15LL03T05]  (hidden comment: GRM033R60J104KE19D)
C280  Capacitance: 100 nF  [CAPC0603X33X15LL03T05]  (hidden comment: GRM033R60J104KE19D)
C281  Capacitance: 100 nF  [CAPC0603X33X15LL03T05]  (hidden comment: GRM033R60J104KE19D)
C282  Capacitance: 100 nF  [CAPC0603X33X15LL03T05]  (hidden comment: GRM033R60J104KE19D)
R208  Resistance: 240 Ohm  [RESC1005X40X25NL05T05]  (hidden comment: ERJ-2RKF2400X)
R209  Resistance: 240 Ohm  [RESC1005X40X25NL05T05]  (hidden comment: ERJ-2RKF2400X)
R210  Resistance: 2 KOhm  [RESC1005X40X25NL05T05]  (hidden comment: ERJ-2RKF2001X)
R211  Resistance: 39 Ohm  [RESC1005X40X25NL5T10]  (hidden comment: RC0402JR-0739RL)
R212  Resistance: 39 Ohm  [RESC1005X40X25NL5T10]  (hidden comment: RC0402JR-0739RL)
R213  Resistance: 39 Ohm  [RESC1005X40X25NL5T10]  (hidden comment: RC0402JR-0739RL)
R214  Resistance: 39 Ohm  [RESC1005X40X25NL5T10]  (hidden comment: RC0402JR-0739RL)
R215  Resistance: 39 Ohm  [RESC1005X40X25NL5T10]  (hidden comment: RC0402JR-0739RL)
R216  Resistance: 39 Ohm  [RESC1005X40X25NL5T10]  (hidden comment: RC0402JR-0739RL)
R217  Resistance: 39 Ohm  [RESC1005X40X25NL5T10]  (hidden comment: RC0402JR-0739RL)
R218  Resistance: 39 Ohm  [RESC1005X40X25NL5T10]  (hidden comment: RC0402JR-0739RL)
R219  Resistance: 39 Ohm  [RESC1005X40X25NL5T10]  (hidden comment: RC0402JR-0739RL)
R220  Resistance: 39 Ohm  [RESC1005X40X25NL5T10]  (hidden comment: RC0402JR-0739RL)
R221  Resistance: 240 Ohm  [RESC1005X40X25NL05T05]  (hidden comment: ERJ-2RKF2400X)
R222  Resistance: 39 Ohm  [RESC1005X40X25NL5T10]  (hidden comment: RC0402JR-0739RL)
R223  Resistance: 240 Ohm  [RESC1005X40X25NL05T05]  (hidden comment: ERJ-2RKF2400X)
R224  Resistance: 39 Ohm  [RESC1005X40X25NL5T10]  (hidden comment: RC0402JR-0739RL)
R225  Resistance: 39 Ohm  [RESC1005X40X25NL5T10]  (hidden comment: RC0402JR-0739RL)
R226  Resistance: 39 Ohm  [RESC1005X40X25NL5T10]  (hidden comment: RC0402JR-0739RL)
U14  MT40A512M16LY-107E  [MICT-LY-96_A]  (parts A,B of 2)
U15  MT40A512M16LY-107E  [MICT-LY-96_A]  (parts A,B of 2)

### Ports
DDR4_ADDR_CTRL_CK (harness DDR4_ADDR_CTRL_CK), DDR4_BYTELINE0 (harness DDR4_BYTELINE0), DDR4_BYTELINE1 (harness DDR4_BYTELINE1), DDR4_BYTELINE2 (harness DDR4_BYTELINE2), DDR4_BYTELINE3 (harness DDR4_BYTELINE3)

### Harnesses
DDR4_BYTELINE0: DQ0, DQ1, DQ2, DQ3, DQ4, DQ5, DQ6, DQ7, DM0, DQS0_P, DQS0_N
DDR4_BYTELINE1: DQ8, DQ9, DQ10, DQ11, DQ12, DQ13, DQ14, DQ15, DM1, DQS1_P, DQS1_N
DDR4_BYTELINE2: DQ16, DQ17, DQ18, DQ19, DQ20, DQ21, DQ22, DQ23, DM2, DQS2_P, DQS2_N
DDR4_BYTELINE3: DQ24, DQ25, DQ26, DQ27, DQ28, DQ29, DQ30, DQ31, DM3, DQS3_P, DQS3_N
DDR4_ADDR_CTRL_CK: A0, A1, A2, A3, A4, A5, A6, A7, A8, A9, A10, A11, A12, A13, BA0, BA1, BG0, CLK_P, CLK_N, CKE, WEn, CAS, RAS, CSn, PAR, ACT, ODT, ALERT0, RESETn, BG1, ALERT1

### Nets
+VrefDDR4: C266.2 C267.2 C282.2 R221.2 R223.2 U14.M1(VREFCA) U15.M1(VREFCA)
GND: C264.1 C265.1 C266.1 C267.1 C268.1 C269.1 C270.1 C271.1 C272.1 C273.1 C274.1 C275.1 C276.1 C277.1 C278.1 C279.1 C280.1 C281.1 C282.1 R223.1 U14.A2(VSSQ) U14.A8(VSSQ) U14.B2(VSS) U14.C9(VSSQ) U14.D2(VSSQ) U14.D8(VSSQ) U14.E1(VSS) U14.E3(VSSQ) U14.E8(VSSQ) U14.E9(VSS) U14.F1(VSSQ) U14.G8(VSS) U14.H1(VSSQ) U14.H9(VSSQ) U14.K1(VSS) U14.K9(VSS) U14.M9(VSS) U14.N1(VSS) U14.N9(TEN) U14.T1(VSS) U15.A2(VSSQ) U15.A8(VSSQ) U15.B2(VSS) U15.C9(VSSQ) U15.D2(VSSQ) U15.D8(VSSQ) U15.E1(VSS) U15.E3(VSSQ) U15.E8(VSSQ) U15.E9(VSS) U15.F1(VSSQ) U15.G8(VSS) U15.H1(VSSQ) U15.H9(VSSQ) U15.K1(VSS) U15.K9(VSS) U15.M9(VSS) U15.N1(VSS) U15.N9(TEN) U15.T1(VSS)
IO_2V5: C264.2 C265.2 U14.B1(VPP) U14.R9(VPP) U15.B1(VPP) U15.R9(VPP)
VDD_DDR: C268.2 C269.2 C270.2 C271.2 C272.2 C273.2 C274.2 C275.2 C276.2 C277.2 C278.2 C279.2 C280.2 C281.2 R208.2 R209.2 R210.2 R211.1 R212.1 R213.1 R214.1 R215.1 R216.1 R217.1 R218.1 R219.1 R220.1 R221.1 R222.1 R224.1 R225.1 R226.1 U14.A1(VDDQ) U14.A9(VDDQ) U14.B3(VDD) U14.B9(VDD) U14.C1(VDDQ) U14.D1(VDD) U14.D9(VDDQ) U14.F2(VDDQ) U14.F8(VDDQ) U14.G1(VDDQ) U14.G7(VDD) U14.G9(VDDQ) U14.J1(VDD) U14.J2(VDDQ) U14.J8(VDDQ) U14.J9(VDD) U14.L1(VDD) U14.L9(VDD) U14.R1(VDD) U14.T9(VDD) U15.A1(VDDQ) U15.A9(VDDQ) U15.B3(VDD) U15.B9(VDD) U15.C1(VDDQ) U15.D1(VDD) U15.D9(VDDQ) U15.F2(VDDQ) U15.F8(VDDQ) U15.G1(VDDQ) U15.G7(VDD) U15.G9(VDDQ) U15.J1(VDD) U15.J2(VDDQ) U15.J8(VDDQ) U15.J9(VDD) U15.L1(VDD) U15.L9(VDD) U15.R1(VDD) U15.T9(VDD)
DDR4_A0: R211.2 U14.P3(A0) U15.P3(A0) ; port DDR4_ADDR_CTRL_CK.A0
DDR4_A1: R212.2 U14.P7(A1) U15.P7(A1) ; port DDR4_ADDR_CTRL_CK.A1
DDR4_A2: R213.2 U14.R3(A2) U15.R3(A2) ; port DDR4_ADDR_CTRL_CK.A2
DDR4_A3: R214.2 U14.N7(A3) U15.N7(A3) ; port DDR4_ADDR_CTRL_CK.A3
DDR4_A4: R215.2 U14.N3(A4) U15.N3(A4) ; port DDR4_ADDR_CTRL_CK.A4
DDR4_A5: R216.2 U14.P8(A5) U15.P8(A5) ; port DDR4_ADDR_CTRL_CK.A5
DDR4_A6: R217.2 U14.P2(A6) U15.P2(A6) ; port DDR4_ADDR_CTRL_CK.A6
DDR4_A7: R218.2 U14.R8(A7) U15.R8(A7) ; port DDR4_ADDR_CTRL_CK.A7
DDR4_A8: R219.2 U14.R2(A8) U15.R2(A8) ; port DDR4_ADDR_CTRL_CK.A8
DDR4_A9: R220.2 U14.R7(A9) U15.R7(A9) ; port DDR4_ADDR_CTRL_CK.A9
DDR4_A10: R222.2 U14.M3(A10/AP) U15.M3(A10/AP) ; port DDR4_ADDR_CTRL_CK.A10
DDR4_A11: R224.2 U14.T2(A11) U15.T2(A11) ; port DDR4_ADDR_CTRL_CK.A11
DDR4_A12: R225.2 U14.M7(A12/BC_N) U15.M7(A12/BC_N) ; port DDR4_ADDR_CTRL_CK.A12
DDR4_A13: R226.2 U14.T8(A13) U15.T8(A13) ; port DDR4_ADDR_CTRL_CK.A13
DDR4_ACT: U14.L3(ACT_N) U15.L3(ACT_N) ; port DDR4_ADDR_CTRL_CK.ACT
DDR4_ALERT0: U15.P9(ALERT_N) ; port DDR4_ADDR_CTRL_CK.ALERT0
DDR4_ALERT1: U14.P9(ALERT_N) ; port DDR4_ADDR_CTRL_CK.ALERT1
DDR4_BA0: U14.N2(BA0) U15.N2(BA0) ; port DDR4_ADDR_CTRL_CK.BA0
DDR4_BA1: U14.N8(BA1) U15.N8(BA1) ; port DDR4_ADDR_CTRL_CK.BA1
DDR4_BG0: U15.M2(BG0) ; port DDR4_ADDR_CTRL_CK.BG0
DDR4_BG1: U14.M2(BG0) ; port DDR4_ADDR_CTRL_CK.BG1
DDR4_CAS: U14.M8(CAS_N/A15) U15.M8(CAS_N/A15) ; port DDR4_ADDR_CTRL_CK.CAS
DDR4_CKE: U14.K2(CKE) U15.K2(CKE) ; port DDR4_ADDR_CTRL_CK.CKE
DDR4_CLK_N: U14.K8(CK_C) U15.K8(CK_C) ; port DDR4_ADDR_CTRL_CK.CLK_N
DDR4_CLK_P: U14.K7(CK_T) U15.K7(CK_T) ; port DDR4_ADDR_CTRL_CK.CLK_P
DDR4_CSn: U14.L7(CS_N) U15.L7(CS_N) ; port DDR4_ADDR_CTRL_CK.CSn
DDR4_DM0: U15.E7(NF/LDM_N/LDBI_N) ; port DDR4_BYTELINE0.DM0
DDR4_DM1: U15.E2(NF/UDM_N/UDBI_N) ; port DDR4_BYTELINE1.DM1
DDR4_DM2: U14.E7(NF/LDM_N/LDBI_N) ; port DDR4_BYTELINE2.DM2
DDR4_DM3: U14.E2(NF/UDM_N/UDBI_N) ; port DDR4_BYTELINE3.DM3
DDR4_DQ0: U15.G2(DQ0) ; port DDR4_BYTELINE0.DQ0
DDR4_DQ1: U15.F7(DQ1) ; port DDR4_BYTELINE0.DQ1
DDR4_DQ2: U15.H3(DQ2) ; port DDR4_BYTELINE0.DQ2
DDR4_DQ3: U15.H7(DQ3) ; port DDR4_BYTELINE0.DQ3
DDR4_DQ4: U15.H2(DQ4) ; port DDR4_BYTELINE0.DQ4
DDR4_DQ5: U15.H8(DQ5) ; port DDR4_BYTELINE0.DQ5
DDR4_DQ6: U15.J3(DQ6) ; port DDR4_BYTELINE0.DQ6
DDR4_DQ7: U15.J7(DQ7) ; port DDR4_BYTELINE0.DQ7
DDR4_DQ8: U15.A3(DQ8) ; port DDR4_BYTELINE1.DQ8
DDR4_DQ9: U15.B8(DQ9) ; port DDR4_BYTELINE1.DQ9
DDR4_DQ10: U15.C3(DQ10) ; port DDR4_BYTELINE1.DQ10
DDR4_DQ11: U15.C7(DQ11) ; port DDR4_BYTELINE1.DQ11
DDR4_DQ12: U15.C2(DQ12) ; port DDR4_BYTELINE1.DQ12
DDR4_DQ13: U15.C8(DQ13) ; port DDR4_BYTELINE1.DQ13
DDR4_DQ14: U15.D3(DQ14) ; port DDR4_BYTELINE1.DQ14
DDR4_DQ15: U15.D7(DQ15) ; port DDR4_BYTELINE1.DQ15
DDR4_DQ16: U14.G2(DQ0) ; port DDR4_BYTELINE2.DQ16
DDR4_DQ17: U14.F7(DQ1) ; port DDR4_BYTELINE2.DQ17
DDR4_DQ18: U14.H3(DQ2) ; port DDR4_BYTELINE2.DQ18
DDR4_DQ19: U14.H7(DQ3) ; port DDR4_BYTELINE2.DQ19
DDR4_DQ20: U14.H2(DQ4) ; port DDR4_BYTELINE2.DQ20
DDR4_DQ21: U14.H8(DQ5) ; port DDR4_BYTELINE2.DQ21
DDR4_DQ22: U14.J3(DQ6) ; port DDR4_BYTELINE2.DQ22
DDR4_DQ23: U14.J7(DQ7) ; port DDR4_BYTELINE2.DQ23
DDR4_DQ24: U14.A3(DQ8) ; port DDR4_BYTELINE3.DQ24
DDR4_DQ25: U14.B8(DQ9) ; port DDR4_BYTELINE3.DQ25
DDR4_DQ26: U14.C3(DQ10) ; port DDR4_BYTELINE3.DQ26
DDR4_DQ27: U14.C7(DQ11) ; port DDR4_BYTELINE3.DQ27
DDR4_DQ28: U14.C2(DQ12) ; port DDR4_BYTELINE3.DQ28
DDR4_DQ29: U14.C8(DQ13) ; port DDR4_BYTELINE3.DQ29
DDR4_DQ30: U14.D3(DQ14) ; port DDR4_BYTELINE3.DQ30
DDR4_DQ31: U14.D7(DQ15) ; port DDR4_BYTELINE3.DQ31
DDR4_DQS0_N: U15.F3(LDQS_C) ; port DDR4_BYTELINE0.DQS0_N
DDR4_DQS0_P: U15.G3(LDQS_T) ; port DDR4_BYTELINE0.DQS0_P
DDR4_DQS1_N: U15.A7(UDQS_C) ; port DDR4_BYTELINE1.DQS1_N
DDR4_DQS1_P: U15.B7(UDQS_T) ; port DDR4_BYTELINE1.DQS1_P
DDR4_DQS2_N: U14.F3(LDQS_C) ; port DDR4_BYTELINE2.DQS2_N
DDR4_DQS2_P: U14.G3(LDQS_T) ; port DDR4_BYTELINE2.DQS2_P
DDR4_DQS3_N: U14.A7(UDQS_C) ; port DDR4_BYTELINE3.DQS3_N
DDR4_DQS3_P: U14.B7(UDQS_T) ; port DDR4_BYTELINE3.DQS3_P
DDR4_ODT: U14.K3(ODT) U15.K3(ODT) ; port DDR4_ADDR_CTRL_CK.ODT
DDR4_PAR: U14.T3(PAR) U15.T3(PAR) ; port DDR4_ADDR_CTRL_CK.PAR
DDR4_RAS: U14.L8(RAS_N/A16) U15.L8(RAS_N/A16) ; port DDR4_ADDR_CTRL_CK.RAS
DDR4_RESETn: R210.1 U14.P1(RESET_N) U15.P1(RESET_N) ; port DDR4_ADDR_CTRL_CK.RESETn
DDR4_WEn: U14.L2(WE_N/A14) U15.L2(WE_N/A14) ; port DDR4_ADDR_CTRL_CK.WEn
NetR208_1: R208.1 U14.F9(ZQ)
NetR209_1: R209.1 U15.F9(ZQ)

Not connected (* = marked no-connect by the designer): U14 T7(NC); U15 T7(NC)

### Layout directives
differential pair: DDR4_CLK_N, DDR4_CLK_P, DDR4_DQS0_N, DDR4_DQS0_P, DDR4_DQS1_N, DDR4_DQS1_P, DDR4_DQS2_N, DDR4_DQS2_P, DDR4_DQS3_N, DDR4_DQS3_P

### Notes on the sheet
- Title
- Size:
- Date:
- B
- Number:
- Time:
- Revision:
- Sheet
- of
- File:

### Library data of the parts
C264-C282 = CMP-2010-01652-4: as C118-C130 on sheet Arria10_Power; Min Operating Temperature: -55 degC; PartNumber: GRM033R60J104KE19D; Mounting Technology: Surface Mount; RoHSCompliant: true; Max Operating Temperature: 85 degC; Package Quantity: 15000; Packaging: Tape and Reel; Tolerance: 10%; Case Code (Imperial): 0201; Width: 0.3 mm; ComponentLink1URL: http://www.murata.com/; Case Code (Metric): 0603; ComponentLink1Description: Manufacturer URL; REACH SVHC: No SVHC; Height: 0.3 mm; Length: 0.6 mm; PackageDescription: 2-Pin Surface Mount Device, Body 0.6 x 0.3 mm; ComponentLink2Description: Datasheet; Pins: 2; PackageReference: 0201; Mount: Surface Mount; ComponentLink2URL: http://search.murata.co.jp/Ceramy/image/img/A01X/G101/ENG/GRM033R60J104KE19-01.pdf; DatasheetVersion: 03/2016; Radiation Hardening: No
R208 R209 R221 R223 = CMP-1665-00034-1: Chip Resistor, 240 Ohm, +/- 1%, 100 mW, -55 to 155 degC, 0402 (1005 Metric), RoHS, Tape and Reel; Power Rating: 100 mW; Voltage Rating: 50 V; Case\/Package: 0402; Packaging: Tape and Reel; Case Code (Imperial): 0402; Mount: Surface Mount; Min Operating Temperature: -55 degC; RoHSCompliant: true; Mounting Technology: Surface Mount; Tolerance: 1%; Max Operating Temperature: 155 degC; REACH SVHC: Unknown; Package Quantity: 10000; ComponentLink1URL: http://www.panasonic.com/; PartNumber: ERJ-2RKF2400X; ComponentLink1Description: Manufacturer URL; Height: 0.35 mm; PackageDescription: 2-Pin Surface Mount Device, Body 1 x 0.5 mm; Width: 0.5 mm; Length: 1 mm; Case Code (Metric): 1005; Radiation Hardening: No; ComponentLink2Description: Datasheet; ComponentLink2URL: http://industrial.panasonic.com/cdbs/www-data/pdf/RDA0000/AOA0000C86.pdf; PackageReference: 0402; DatasheetVersion: 04/2015; Pins: 2
R210 = CMP-2002-00758-3: Chip Resistor, 2 KOhm, +/- 1%, 100 mW, -55 to 155 degC, 0402 (1005 Metric), RoHS, Tape and Reel; Manufacturer: Basic Passives; Voltage Rating: 50 V; Power Rating: 100 mW; Case\/Package: 0402; Min Operating Temperature: -55 degC; Tolerance: 1%; REACH SVHC: Unknown; Case Code (Metric): 1005; PackageDescription: 2-Pin Surface Mount Device, Body 1 x 0.5 mm; RoHSCompliant: true; Packaging: Tape and Reel; Length: 1 mm; ComponentLink1Description: Manufacturer URL; Case Code (Imperial): 0402; Mounting Technology: Surface Mount; Package Quantity: 10000; Height: 0.35 mm; Width: 0.5 mm; Mount: Surface Mount; ComponentLink1URL: http://www.panasonic.com/; PartNumber: ERJ-2RKF2001X; Max Operating Temperature: 155 degC; PackageReference: 0402; DatasheetVersion: 04/2015; Pins: 2; Radiation Hardening: No; ComponentLink2Description: Datasheet; ComponentLink2URL: http://industrial.panasonic.com/cdbs/www-data/pdf/RDA0000/AOA0000C86.pdf
R211-R220 R222 R224-R226 = CMP-2002-07994-2: Chip Resistor, 39 Ohm, +/- 5%, 0.063 W, -55 to 155 degC, 0402 (1005 Metric), RoHS, Tape and Reel; Power Rating: 63 mW; Voltage Rating (DC): 50 V; Case Code (Imperial): 0402; Mount: Surface Mount; Max Operating Temperature: 155 degC; Case Code (Metric): 1005; ComponentLink1Description: Manufacturer URL; PackageDescription: 2-Pin Surface Mount Device, Body 1 x 0.5 mm; PartNumber: RC0402JR-0739RL; ComponentLink2Description: Datasheet; Tolerance: 5%; Height: 0.35 mm; Pins: 2; Min Operating Temperature: -55 degC; Length: 1 mm; DatasheetVersion: Rev. 4, 02/2016; ComponentLink2URL: http://www.yageo.com/documents/recent/PYu-RC_Group_51_RoHS_L_04.pdf; Mounting Technology: Surface Mount; Packaging: Cut Tape; Case/Package: 0402; Package Quantity: 1; RoHSCompliant: true; REACH SVHC: No SVHC; Width: 0.5 mm; Voltage Rating: 50 V; ComponentLink1URL: http://www.yageo.com/
U14 U15 = CMP-1718-00002-1: 8 Gb DDR4 SDRAM, 512 Meg x 16, 1.2 V, 0 to 95 degC, 96-Ball FBGA (LY), RoHS; Mounting Technology: Surface Mount; ComponentLink1URL: http://www.micron.com/; ComponentLink2Description: Datasheet; PartNumber: MT40A512M16LY-107E; DatasheetVersion: Rev. E, 05/2016; ComponentLink1Description: Manufacturer URL; ComponentLink2URL: https://www.micron.com/~/media/documents/products/data-sheet/dram/ddr4/8gb_ddr4_sdram.pdf; PackageDescription: 96-Ball Fine Pitch Ball Grid Array, Body 7.5 x 13.5 mm, Pitch 0.8 mm; PartId: 1

## Sheet DDR4_SODIMM1.SchDoc: DDR4 SODIMM CONNECTOR1
size C; DocumentNumber: 3; SheetNumber: 3; SheetTotal: 46
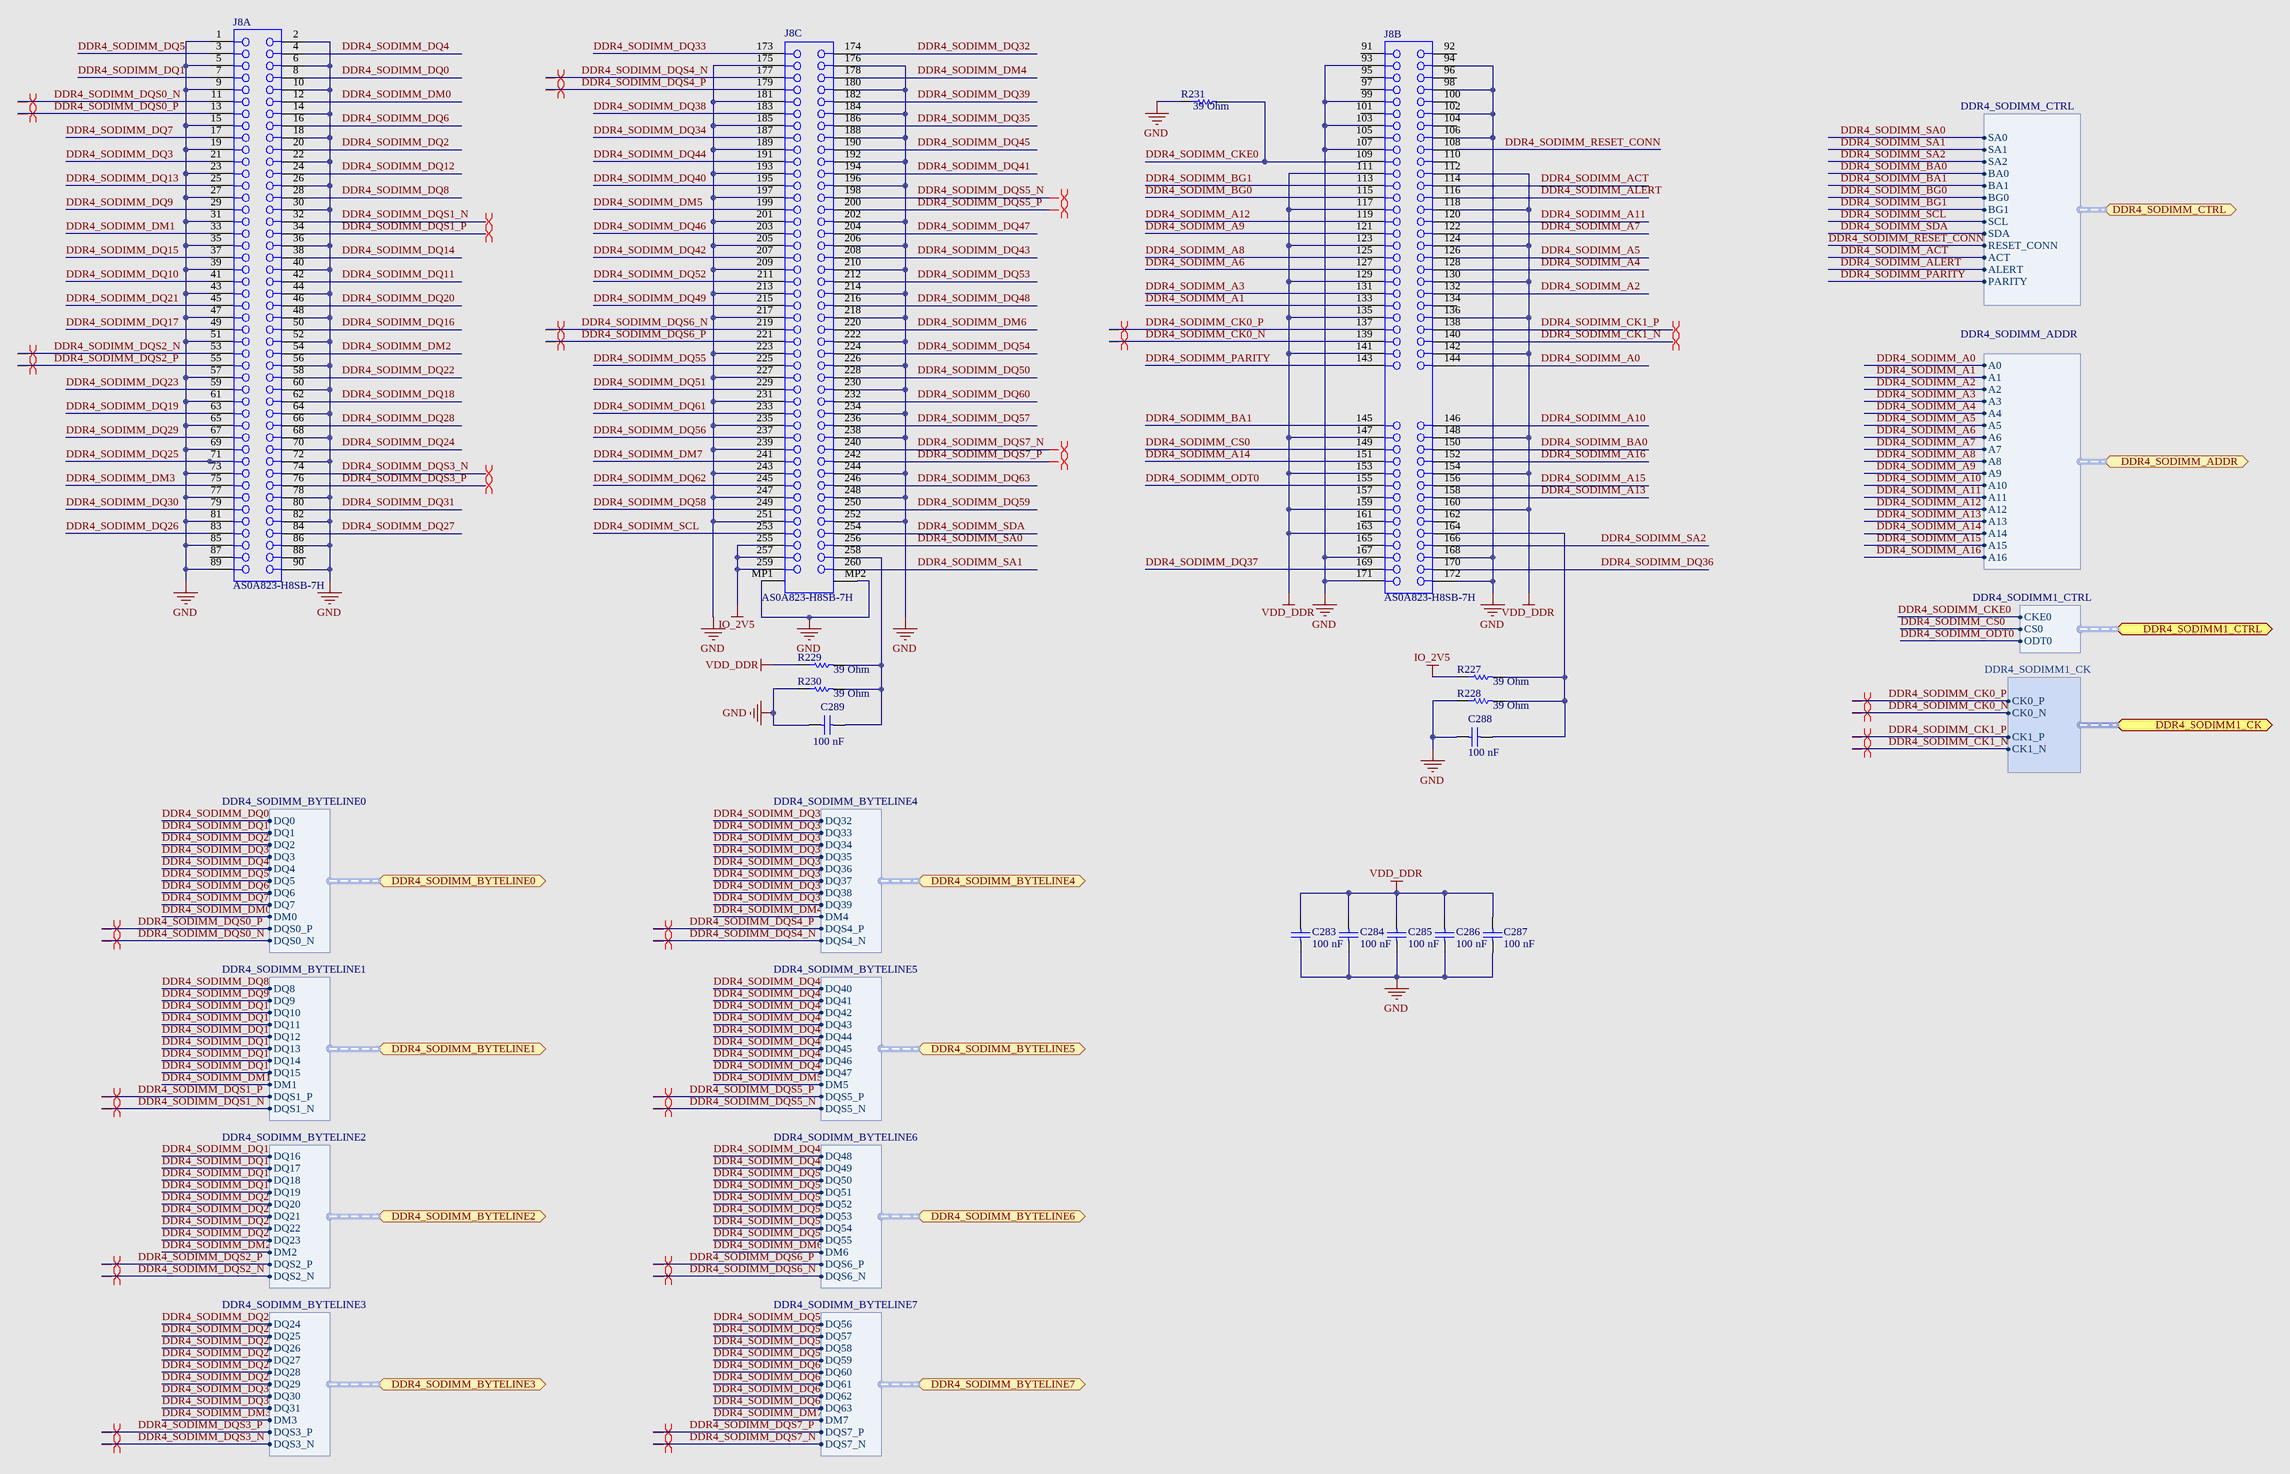
[diagram p22: DDR4_SODIMM1.SchDoc]

### Parts
C283  Capacitance: 100 nF  [CAPC1005X55X10LL05]  (hidden comment: C1005X7R1E104M)
C284  Capacitance: 100 nF  [CAPC1005X55X10LL05]  (hidden comment: C1005X7R1E104M)
C285  Capacitance: 100 nF  [CAPC1005X55X10LL05]  (hidden comment: C1005X7R1E104M)
C286  Capacitance: 100 nF  [CAPC1005X55X10LL05]  (hidden comment: C1005X7R1E104M)
C287  Capacitance: 100 nF  [CAPC1005X55X10LL05]  (hidden comment: C1005X7R1E104M)
C288  Capacitance: 100 nF  [CAPC1005X55X10LL05]  (hidden comment: C1005X7R1E104M)
C289  Capacitance: 100 nF  [CAPC1005X55X10LL05]  (hidden comment: C1005X7R1E104M)
J8  AS0A823-H8SB-7H  [FOXC-AS0A823-H8SB-7H_V]  (parts A,B,C of 3)
R227  Resistance: 39 Ohm  [RESC1005X40X25NL5T10]  (hidden comment: RC0402JR-0739RL)
R228  Resistance: 39 Ohm  [RESC1005X40X25NL5T10]  (hidden comment: RC0402JR-0739RL)
R229  Resistance: 39 Ohm  [RESC1005X40X25NL5T10]  (hidden comment: RC0402JR-0739RL)
R230  Resistance: 39 Ohm  [RESC1005X40X25NL5T10]  (hidden comment: RC0402JR-0739RL)
R231  Resistance: 39 Ohm  [RESC1005X40X25NL5T10]  (hidden comment: RC0402JR-0739RL)

### Ports
DDR4_SODIMM1_CK (harness DDR4_SODIMM1_CK), DDR4_SODIMM1_CTRL (harness DDR4_SODIMM1_CTRL), DDR4_SODIMM_ADDR (harness DDR4_SODIMM_ADDR), DDR4_SODIMM_BYTELINE0 (harness DDR4_SODIMM_BYTELINE0), DDR4_SODIMM_BYTELINE1 (harness DDR4_SODIMM_BYTELINE1), DDR4_SODIMM_BYTELINE2 (harness DDR4_SODIMM_BYTELINE2), DDR4_SODIMM_BYTELINE3 (harness DDR4_SODIMM_BYTELINE3), DDR4_SODIMM_BYTELINE4 (harness DDR4_SODIMM_BYTELINE4), DDR4_SODIMM_BYTELINE5 (harness DDR4_SODIMM_BYTELINE5), DDR4_SODIMM_BYTELINE6 (harness DDR4_SODIMM_BYTELINE6), DDR4_SODIMM_BYTELINE7 (harness DDR4_SODIMM_BYTELINE7), DDR4_SODIMM_CTRL (harness DDR4_SODIMM_CTRL)

### Harnesses
DDR4_SODIMM_BYTELINE0: DQ0, DQ1, DQ2, DQ3, DQ4, DQ5, DQ6, DQ7, DM0, DQS0_P, DQS0_N
DDR4_SODIMM_BYTELINE1: DQ8, DQ9, DQ10, DQ11, DQ12, DQ13, DQ14, DQ15, DM1, DQS1_P, DQS1_N
DDR4_SODIMM_BYTELINE2: DQ16, DQ17, DQ18, DQ19, DQ20, DQ21, DQ22, DQ23, DM2, DQS2_P, DQS2_N
DDR4_SODIMM_BYTELINE3: DQ24, DQ25, DQ26, DQ27, DQ28, DQ29, DQ30, DQ31, DM3, DQS3_P, DQS3_N
DDR4_SODIMM_BYTELINE4: DQ32, DQ33, DQ34, DQ35, DQ36, DQ37, DQ38, DQ39, DM4, DQS4_P, DQS4_N
DDR4_SODIMM_BYTELINE5: DQ40, DQ41, DQ42, DQ43, DQ44, DQ45, DQ46, DQ47, DM5, DQS5_P, DQS5_N
DDR4_SODIMM_BYTELINE6: DQ48, DQ49, DQ50, DQ51, DQ52, DQ53, DQ54, DQ55, DM6, DQS6_P, DQS6_N
DDR4_SODIMM_BYTELINE7: DQ56, DQ57, DQ58, DQ59, DQ60, DQ61, DQ62, DQ63, DM7, DQS7_P, DQS7_N
DDR4_SODIMM_CTRL: SA0, SA1, SA2, BA0, BA1, BG0, BG1, SCL, SDA, RESET_CONN, ACT, ALERT, PARITY
DDR4_SODIMM1_CTRL: CKE0, CS0, ODT0
DDR4_SODIMM_ADDR: A0, A2, A1, A3, A4, A5, A6, A7, A9, A8, A10, A11, A12, A13, A14, A15, A16
DDR4_SODIMM1_CK: CK0_P, CK0_N, CK1_P, CK1_N

### Nets
GND: C283.2 C284.2 C285.2 C286.2 C287.2 C288.1 C289.2 J8.1 J8.2 J8.5 J8.6 J8.9 J8.10 J8.14 J8.15 J8.18 J8.19 J8.22 J8.23 J8.26 J8.27 J8.30 J8.31 J8.35 J8.36 J8.39 J8.40 J8.43 J8.44 J8.47 J8.48 J8.51 J8.52 J8.56 J8.57 J8.60 J8.61 J8.64 J8.65 J8.68 J8.69 J8.72 J8.73 J8.77 J8.78 J8.81 J8.82 J8.85 J8.86 J8.89 J8.90 J8.93 J8.94 J8.98 J8.99 J8.102 J8.103 J8.106 J8.107 J8.167 J8.168 J8.171 J8.172 J8.175 J8.176 J8.180 J8.181 J8.184 J8.185 J8.188 J8.189 J8.192 J8.193 J8.196 J8.197 J8.201 J8.202 J8.205 J8.206 J8.209 J8.210 J8.213 J8.214 J8.217 J8.218 J8.222 J8.223 J8.226 J8.227 J8.230 J8.231 J8.234 J8.235 J8.238 J8.239 J8.243 J8.244 J8.247 J8.248 J8.251 J8.252 J8.MP1 J8.MP2 R228.1 R230.1 R231.1
IO_2V5: J8.255 J8.257 J8.259 R227.1
VDD_DDR: C283.1 C284.1 C285.1 C286.1 C287.1 J8.111 J8.112 J8.117 J8.118 J8.123 J8.124 J8.129 J8.130 J8.135 J8.136 J8.141 J8.142 J8.147 J8.148 J8.153 J8.154 J8.159 J8.160 J8.163 R229.1
DDR4_SODIMM_A0: J8.144 ; port DDR4_SODIMM_ADDR.A0
DDR4_SODIMM_A1: J8.133 ; port DDR4_SODIMM_ADDR.A1
DDR4_SODIMM_A2: J8.132 ; port DDR4_SODIMM_ADDR.A2
DDR4_SODIMM_A3: J8.131 ; port DDR4_SODIMM_ADDR.A3
DDR4_SODIMM_A4: J8.128 ; port DDR4_SODIMM_ADDR.A4
DDR4_SODIMM_A5: J8.126 ; port DDR4_SODIMM_ADDR.A5
DDR4_SODIMM_A6: J8.127 ; port DDR4_SODIMM_ADDR.A6
DDR4_SODIMM_A7: J8.122 ; port DDR4_SODIMM_ADDR.A7
DDR4_SODIMM_A8: J8.125 ; port DDR4_SODIMM_ADDR.A8
DDR4_SODIMM_A9: J8.121 ; port DDR4_SODIMM_ADDR.A9
DDR4_SODIMM_A10: J8.146 ; port DDR4_SODIMM_ADDR.A10
DDR4_SODIMM_A11: J8.120 ; port DDR4_SODIMM_ADDR.A11
DDR4_SODIMM_A12: J8.119 ; port DDR4_SODIMM_ADDR.A12
DDR4_SODIMM_A13: J8.158 ; port DDR4_SODIMM_ADDR.A13
DDR4_SODIMM_A14: J8.151 ; port DDR4_SODIMM_ADDR.A14
DDR4_SODIMM_A15: J8.156 ; port DDR4_SODIMM_ADDR.A15
DDR4_SODIMM_A16: J8.152 ; port DDR4_SODIMM_ADDR.A16
DDR4_SODIMM_ACT: J8.114 ; port DDR4_SODIMM_CTRL.ACT
DDR4_SODIMM_ALERT: J8.116 ; port DDR4_SODIMM_CTRL.ALERT
DDR4_SODIMM_BA0: J8.150 ; port DDR4_SODIMM_CTRL.BA0
DDR4_SODIMM_BA1: J8.145 ; port DDR4_SODIMM_CTRL.BA1
DDR4_SODIMM_BG0: J8.115 ; port DDR4_SODIMM_CTRL.BG0
DDR4_SODIMM_BG1: J8.113 ; port DDR4_SODIMM_CTRL.BG1
DDR4_SODIMM_CK0_N: J8.139 ; port DDR4_SODIMM1_CK.CK0_N
DDR4_SODIMM_CK0_P: J8.137 ; port DDR4_SODIMM1_CK.CK0_P
DDR4_SODIMM_CK1_N: J8.140 ; port DDR4_SODIMM1_CK.CK1_N
DDR4_SODIMM_CK1_P: J8.138 ; port DDR4_SODIMM1_CK.CK1_P
DDR4_SODIMM_CKE0: J8.109 R231.2 ; port DDR4_SODIMM1_CTRL.CKE0
DDR4_SODIMM_CS0: J8.149 ; port DDR4_SODIMM1_CTRL.CS0
DDR4_SODIMM_DM0: J8.12 ; port DDR4_SODIMM_BYTELINE0.DM0
DDR4_SODIMM_DM1: J8.33 ; port DDR4_SODIMM_BYTELINE1.DM1
DDR4_SODIMM_DM2: J8.54 ; port DDR4_SODIMM_BYTELINE2.DM2
DDR4_SODIMM_DM3: J8.75 ; port DDR4_SODIMM_BYTELINE3.DM3
DDR4_SODIMM_DM4: J8.178 ; port DDR4_SODIMM_BYTELINE4.DM4
DDR4_SODIMM_DM5: J8.199 ; port DDR4_SODIMM_BYTELINE5.DM5
DDR4_SODIMM_DM6: J8.220 ; port DDR4_SODIMM_BYTELINE6.DM6
DDR4_SODIMM_DM7: J8.241 ; port DDR4_SODIMM_BYTELINE7.DM7
DDR4_SODIMM_DQ0: J8.8 ; port DDR4_SODIMM_BYTELINE0.DQ0
DDR4_SODIMM_DQ1: J8.7 ; port DDR4_SODIMM_BYTELINE0.DQ1
DDR4_SODIMM_DQ2: J8.20 ; port DDR4_SODIMM_BYTELINE0.DQ2
DDR4_SODIMM_DQ3: J8.21 ; port DDR4_SODIMM_BYTELINE0.DQ3
DDR4_SODIMM_DQ4: J8.4 ; port DDR4_SODIMM_BYTELINE0.DQ4
DDR4_SODIMM_DQ5: J8.3 ; port DDR4_SODIMM_BYTELINE0.DQ5
DDR4_SODIMM_DQ6: J8.16 ; port DDR4_SODIMM_BYTELINE0.DQ6
DDR4_SODIMM_DQ7: J8.17 ; port DDR4_SODIMM_BYTELINE0.DQ7
DDR4_SODIMM_DQ8: J8.28 ; port DDR4_SODIMM_BYTELINE1.DQ8
DDR4_SODIMM_DQ9: J8.29 ; port DDR4_SODIMM_BYTELINE1.DQ9
DDR4_SODIMM_DQ10: J8.41 ; port DDR4_SODIMM_BYTELINE1.DQ10
DDR4_SODIMM_DQ11: J8.42 ; port DDR4_SODIMM_BYTELINE1.DQ11
DDR4_SODIMM_DQ12: J8.24 ; port DDR4_SODIMM_BYTELINE1.DQ12
DDR4_SODIMM_DQ13: J8.25 ; port DDR4_SODIMM_BYTELINE1.DQ13
DDR4_SODIMM_DQ14: J8.38 ; port DDR4_SODIMM_BYTELINE1.DQ14
DDR4_SODIMM_DQ15: J8.37 ; port DDR4_SODIMM_BYTELINE1.DQ15
DDR4_SODIMM_DQ16: J8.50 ; port DDR4_SODIMM_BYTELINE2.DQ16
DDR4_SODIMM_DQ17: J8.49 ; port DDR4_SODIMM_BYTELINE2.DQ17
DDR4_SODIMM_DQ18: J8.62 ; port DDR4_SODIMM_BYTELINE2.DQ18
DDR4_SODIMM_DQ19: J8.63 ; port DDR4_SODIMM_BYTELINE2.DQ19
DDR4_SODIMM_DQ20: J8.46 ; port DDR4_SODIMM_BYTELINE2.DQ20
DDR4_SODIMM_DQ21: J8.45 ; port DDR4_SODIMM_BYTELINE2.DQ21
DDR4_SODIMM_DQ22: J8.58 ; port DDR4_SODIMM_BYTELINE2.DQ22
DDR4_SODIMM_DQ23: J8.59 ; port DDR4_SODIMM_BYTELINE2.DQ23
DDR4_SODIMM_DQ24: J8.70 ; port DDR4_SODIMM_BYTELINE3.DQ24
DDR4_SODIMM_DQ25: J8.71 ; port DDR4_SODIMM_BYTELINE3.DQ25
DDR4_SODIMM_DQ26: J8.83 ; port DDR4_SODIMM_BYTELINE3.DQ26
DDR4_SODIMM_DQ27: J8.84 ; port DDR4_SODIMM_BYTELINE3.DQ27
DDR4_SODIMM_DQ28: J8.66 ; port DDR4_SODIMM_BYTELINE3.DQ28
DDR4_SODIMM_DQ29: J8.67 ; port DDR4_SODIMM_BYTELINE3.DQ29
DDR4_SODIMM_DQ30: J8.79 ; port DDR4_SODIMM_BYTELINE3.DQ30
DDR4_SODIMM_DQ31: J8.80 ; port DDR4_SODIMM_BYTELINE3.DQ31
DDR4_SODIMM_DQ32: J8.174 ; port DDR4_SODIMM_BYTELINE4.DQ32
DDR4_SODIMM_DQ33: J8.173 ; port DDR4_SODIMM_BYTELINE4.DQ33
DDR4_SODIMM_DQ34: J8.187 ; port DDR4_SODIMM_BYTELINE4.DQ34
DDR4_SODIMM_DQ35: J8.186 ; port DDR4_SODIMM_BYTELINE4.DQ35
DDR4_SODIMM_DQ36: J8.170 ; port DDR4_SODIMM_BYTELINE4.DQ36
DDR4_SODIMM_DQ37: J8.169 ; port DDR4_SODIMM_BYTELINE4.DQ37
DDR4_SODIMM_DQ38: J8.183 ; port DDR4_SODIMM_BYTELINE4.DQ38
DDR4_SODIMM_DQ39: J8.182 ; port DDR4_SODIMM_BYTELINE4.DQ39
DDR4_SODIMM_DQ40: J8.195 ; port DDR4_SODIMM_BYTELINE5.DQ40
DDR4_SODIMM_DQ41: J8.194 ; port DDR4_SODIMM_BYTELINE5.DQ41
DDR4_SODIMM_DQ42: J8.207 ; port DDR4_SODIMM_BYTELINE5.DQ42
DDR4_SODIMM_DQ43: J8.208 ; port DDR4_SODIMM_BYTELINE5.DQ43
DDR4_SODIMM_DQ44: J8.191 ; port DDR4_SODIMM_BYTELINE5.DQ44
DDR4_SODIMM_DQ45: J8.190 ; port DDR4_SODIMM_BYTELINE5.DQ45
DDR4_SODIMM_DQ46: J8.203 ; port DDR4_SODIMM_BYTELINE5.DQ46
DDR4_SODIMM_DQ47: J8.204 ; port DDR4_SODIMM_BYTELINE5.DQ47
DDR4_SODIMM_DQ48: J8.216 ; port DDR4_SODIMM_BYTELINE6.DQ48
DDR4_SODIMM_DQ49: J8.215 ; port DDR4_SODIMM_BYTELINE6.DQ49
DDR4_SODIMM_DQ50: J8.228 ; port DDR4_SODIMM_BYTELINE6.DQ50
DDR4_SODIMM_DQ51: J8.229 ; port DDR4_SODIMM_BYTELINE6.DQ51
DDR4_SODIMM_DQ52: J8.211 ; port DDR4_SODIMM_BYTELINE6.DQ52
DDR4_SODIMM_DQ53: J8.212 ; port DDR4_SODIMM_BYTELINE6.DQ53
DDR4_SODIMM_DQ54: J8.224 ; port DDR4_SODIMM_BYTELINE6.DQ54
DDR4_SODIMM_DQ55: J8.225 ; port DDR4_SODIMM_BYTELINE6.DQ55
DDR4_SODIMM_DQ56: J8.237 ; port DDR4_SODIMM_BYTELINE7.DQ56
DDR4_SODIMM_DQ57: J8.236 ; port DDR4_SODIMM_BYTELINE7.DQ57
DDR4_SODIMM_DQ58: J8.249 ; port DDR4_SODIMM_BYTELINE7.DQ58
DDR4_SODIMM_DQ59: J8.250 ; port DDR4_SODIMM_BYTELINE7.DQ59
DDR4_SODIMM_DQ60: J8.232 ; port DDR4_SODIMM_BYTELINE7.DQ60
DDR4_SODIMM_DQ61: J8.233 ; port DDR4_SODIMM_BYTELINE7.DQ61
DDR4_SODIMM_DQ62: J8.245 ; port DDR4_SODIMM_BYTELINE7.DQ62
DDR4_SODIMM_DQ63: J8.246 ; port DDR4_SODIMM_BYTELINE7.DQ63
DDR4_SODIMM_DQS0_N: J8.11 ; port DDR4_SODIMM_BYTELINE0.DQS0_N
DDR4_SODIMM_DQS0_P: J8.13 ; port DDR4_SODIMM_BYTELINE0.DQS0_P
DDR4_SODIMM_DQS1_N: J8.32 ; port DDR4_SODIMM_BYTELINE1.DQS1_N
DDR4_SODIMM_DQS1_P: J8.34 ; port DDR4_SODIMM_BYTELINE1.DQS1_P
DDR4_SODIMM_DQS2_N: J8.53 ; port DDR4_SODIMM_BYTELINE2.DQS2_N
DDR4_SODIMM_DQS2_P: J8.55 ; port DDR4_SODIMM_BYTELINE2.DQS2_P
DDR4_SODIMM_DQS3_N: J8.74 ; port DDR4_SODIMM_BYTELINE3.DQS3_N
DDR4_SODIMM_DQS3_P: J8.76 ; port DDR4_SODIMM_BYTELINE3.DQS3_P
DDR4_SODIMM_DQS4_N: J8.177 ; port DDR4_SODIMM_BYTELINE4.DQS4_N
DDR4_SODIMM_DQS4_P: J8.179 ; port DDR4_SODIMM_BYTELINE4.DQS4_P
DDR4_SODIMM_DQS5_N: J8.198 ; port DDR4_SODIMM_BYTELINE5.DQS5_N
DDR4_SODIMM_DQS5_P: J8.200 ; port DDR4_SODIMM_BYTELINE5.DQS5_P
DDR4_SODIMM_DQS6_N: J8.219 ; port DDR4_SODIMM_BYTELINE6.DQS6_N
DDR4_SODIMM_DQS6_P: J8.221 ; port DDR4_SODIMM_BYTELINE6.DQS6_P
DDR4_SODIMM_DQS7_N: J8.240 ; port DDR4_SODIMM_BYTELINE7.DQS7_N
DDR4_SODIMM_DQS7_P: J8.242 ; port DDR4_SODIMM_BYTELINE7.DQS7_P
DDR4_SODIMM_ODT0: J8.155 ; port DDR4_SODIMM1_CTRL.ODT0
DDR4_SODIMM_PARITY: J8.143 ; port DDR4_SODIMM_CTRL.PARITY
DDR4_SODIMM_RESET_CONN: J8.108 ; port DDR4_SODIMM_CTRL.RESET_CONN
DDR4_SODIMM_SA0: J8.256 ; port DDR4_SODIMM_CTRL.SA0
DDR4_SODIMM_SA1: J8.260 ; port DDR4_SODIMM_CTRL.SA1
DDR4_SODIMM_SA2: J8.166 ; port DDR4_SODIMM_CTRL.SA2
DDR4_SODIMM_SCL: J8.253 ; port DDR4_SODIMM_CTRL.SCL
DDR4_SODIMM_SDA: J8.254 ; port DDR4_SODIMM_CTRL.SDA
NetC288_2: C288.2 J8.164 R227.2 R228.2
NetC289_1: C289.1 J8.258 R229.2 R230.2

Not connected (* = marked no-connect by the designer): J8 87 88 91 92 95 96 97 100 101 104 105 110 134 157 161 162 165

### Layout directives
differential pair: DDR4_SODIMM_CK0_N, DDR4_SODIMM_CK0_P, DDR4_SODIMM_CK1_N, DDR4_SODIMM_CK1_P, DDR4_SODIMM_DQS0_N, DDR4_SODIMM_DQS0_P, DDR4_SODIMM_DQS1_N, DDR4_SODIMM_DQS1_P, DDR4_SODIMM_DQS2_N, DDR4_SODIMM_DQS2_P, DDR4_SODIMM_DQS3_N, DDR4_SODIMM_DQS3_P, DDR4_SODIMM_DQS4_N, DDR4_SODIMM_DQS4_P, DDR4_SODIMM_DQS5_N, DDR4_SODIMM_DQS5_P, DDR4_SODIMM_DQS6_N, DDR4_SODIMM_DQS6_P, DDR4_SODIMM_DQS7_N, DDR4_SODIMM_DQS7_P

### Notes on the sheet
- Title
- Size:
- Date:
- File:
- B
- Number:
- Time:
- Revision:
- Sheet
- of

### Library data of the parts
C283-C289 = CMP-1663-00009-2: as C131 on sheet Arria10_Power; Tolerance: 20%; Mounting Technology: Surface Mount; Max Operating Temperature: 125 degC; ComponentLink2URL: http://www.farnell.com/datasheets/1571323.pdf; ComponentLink1URL: http://www.tdk.com/; RoHSCompliant: true; Packaging: Tape and Reel; ComponentLink2Description: Datasheet; Case Code (Imperial): 0402; DatasheetVersion: 09/2011; ComponentLink1Description: Manufacturer URL; PackageDescription: 2-Pin Surface Mount Device, Body 1 x 0.5 mm; PackageReference: 0402; Min Operating Temperature: -55 degC; Case Code (Metric): 1005; Height: 0.5 mm; Package Quantity: 10000; Width: 0.5 mm; Pins: 2; Voltage Rating (DC): 25 V; PartNumber: C1005X7R1E104M; Mount: Surface Mount; Length: 1 mm
J8 = CMP-1735-00002-1: Surface Mount Horizontal Type DDR4 DIMM Socket Connector, 260 Position, Pitch 0.5 mm, -55 to 85 degC, Halogen/Lead Free, Tape and Reel; Mounting Technology: Surface Mount; ComponentLink1URL: http://www.foxconn.com/; ComponentLink2URL: https://drive.google.com/drive/folders/0By4GUdJb-DJ9Um5lRWw4YjB4d2c; PackageDescription: 260-Pin Surface Mount Device, Body Length 73.1 mm, Pitch 0.5 mm; PartNumber: AS0A823-H8SB-7H; DatasheetVersion: Rev. A, 10/2013; ComponentLink1Description: Manufacturer URL; ComponentLink2Description: Surface Mount; System: Connector
R227-R231 = CMP-2002-07994-2: as R211-R220 on sheet DDR4; Case Code (Imperial): 0402; Mount: Surface Mount; Max Operating Temperature: 155 degC; Case Code (Metric): 1005; ComponentLink1Description: Manufacturer URL; PackageDescription: 2-Pin Surface Mount Device, Body 1 x 0.5 mm; PartNumber: RC0402JR-0739RL; ComponentLink2Description: Datasheet; Tolerance: 5%; Height: 0.35 mm; Pins: 2; Min Operating Temperature: -55 degC; Length: 1 mm; DatasheetVersion: Rev. 4, 02/2016; ComponentLink2URL: http://www.yageo.com/documents/recent/PYu-RC_Group_51_RoHS_L_04.pdf; Mounting Technology: Surface Mount; Packaging: Cut Tape; Case/Package: 0402; Package Quantity: 1; RoHSCompliant: true; REACH SVHC: No SVHC; Width: 0.5 mm; Voltage Rating: 50 V; ComponentLink1URL: http://www.yageo.com/